# Altium project 1-5kw.PrjPcb (part 2 of 2)

## Sheet 信号采集板.SchDoc
size A2; PageSetup: Record=PageOptions|CenterHorizontal=True|CenterVertical=True|PrintScale=0.50|XCorrection=1.00|YCorrection=1.00|PrintKind=1|BorderSize=5000000|LeftOffset=0|BottomOffset=0|Orientation=2|PaperLength=1000|PaperWidth=1000|Scale=100|PaperSource=15|PrintQuality=600|MediaType=1|DitherType=10|PaperKind=A3|PrintScaleMode=1
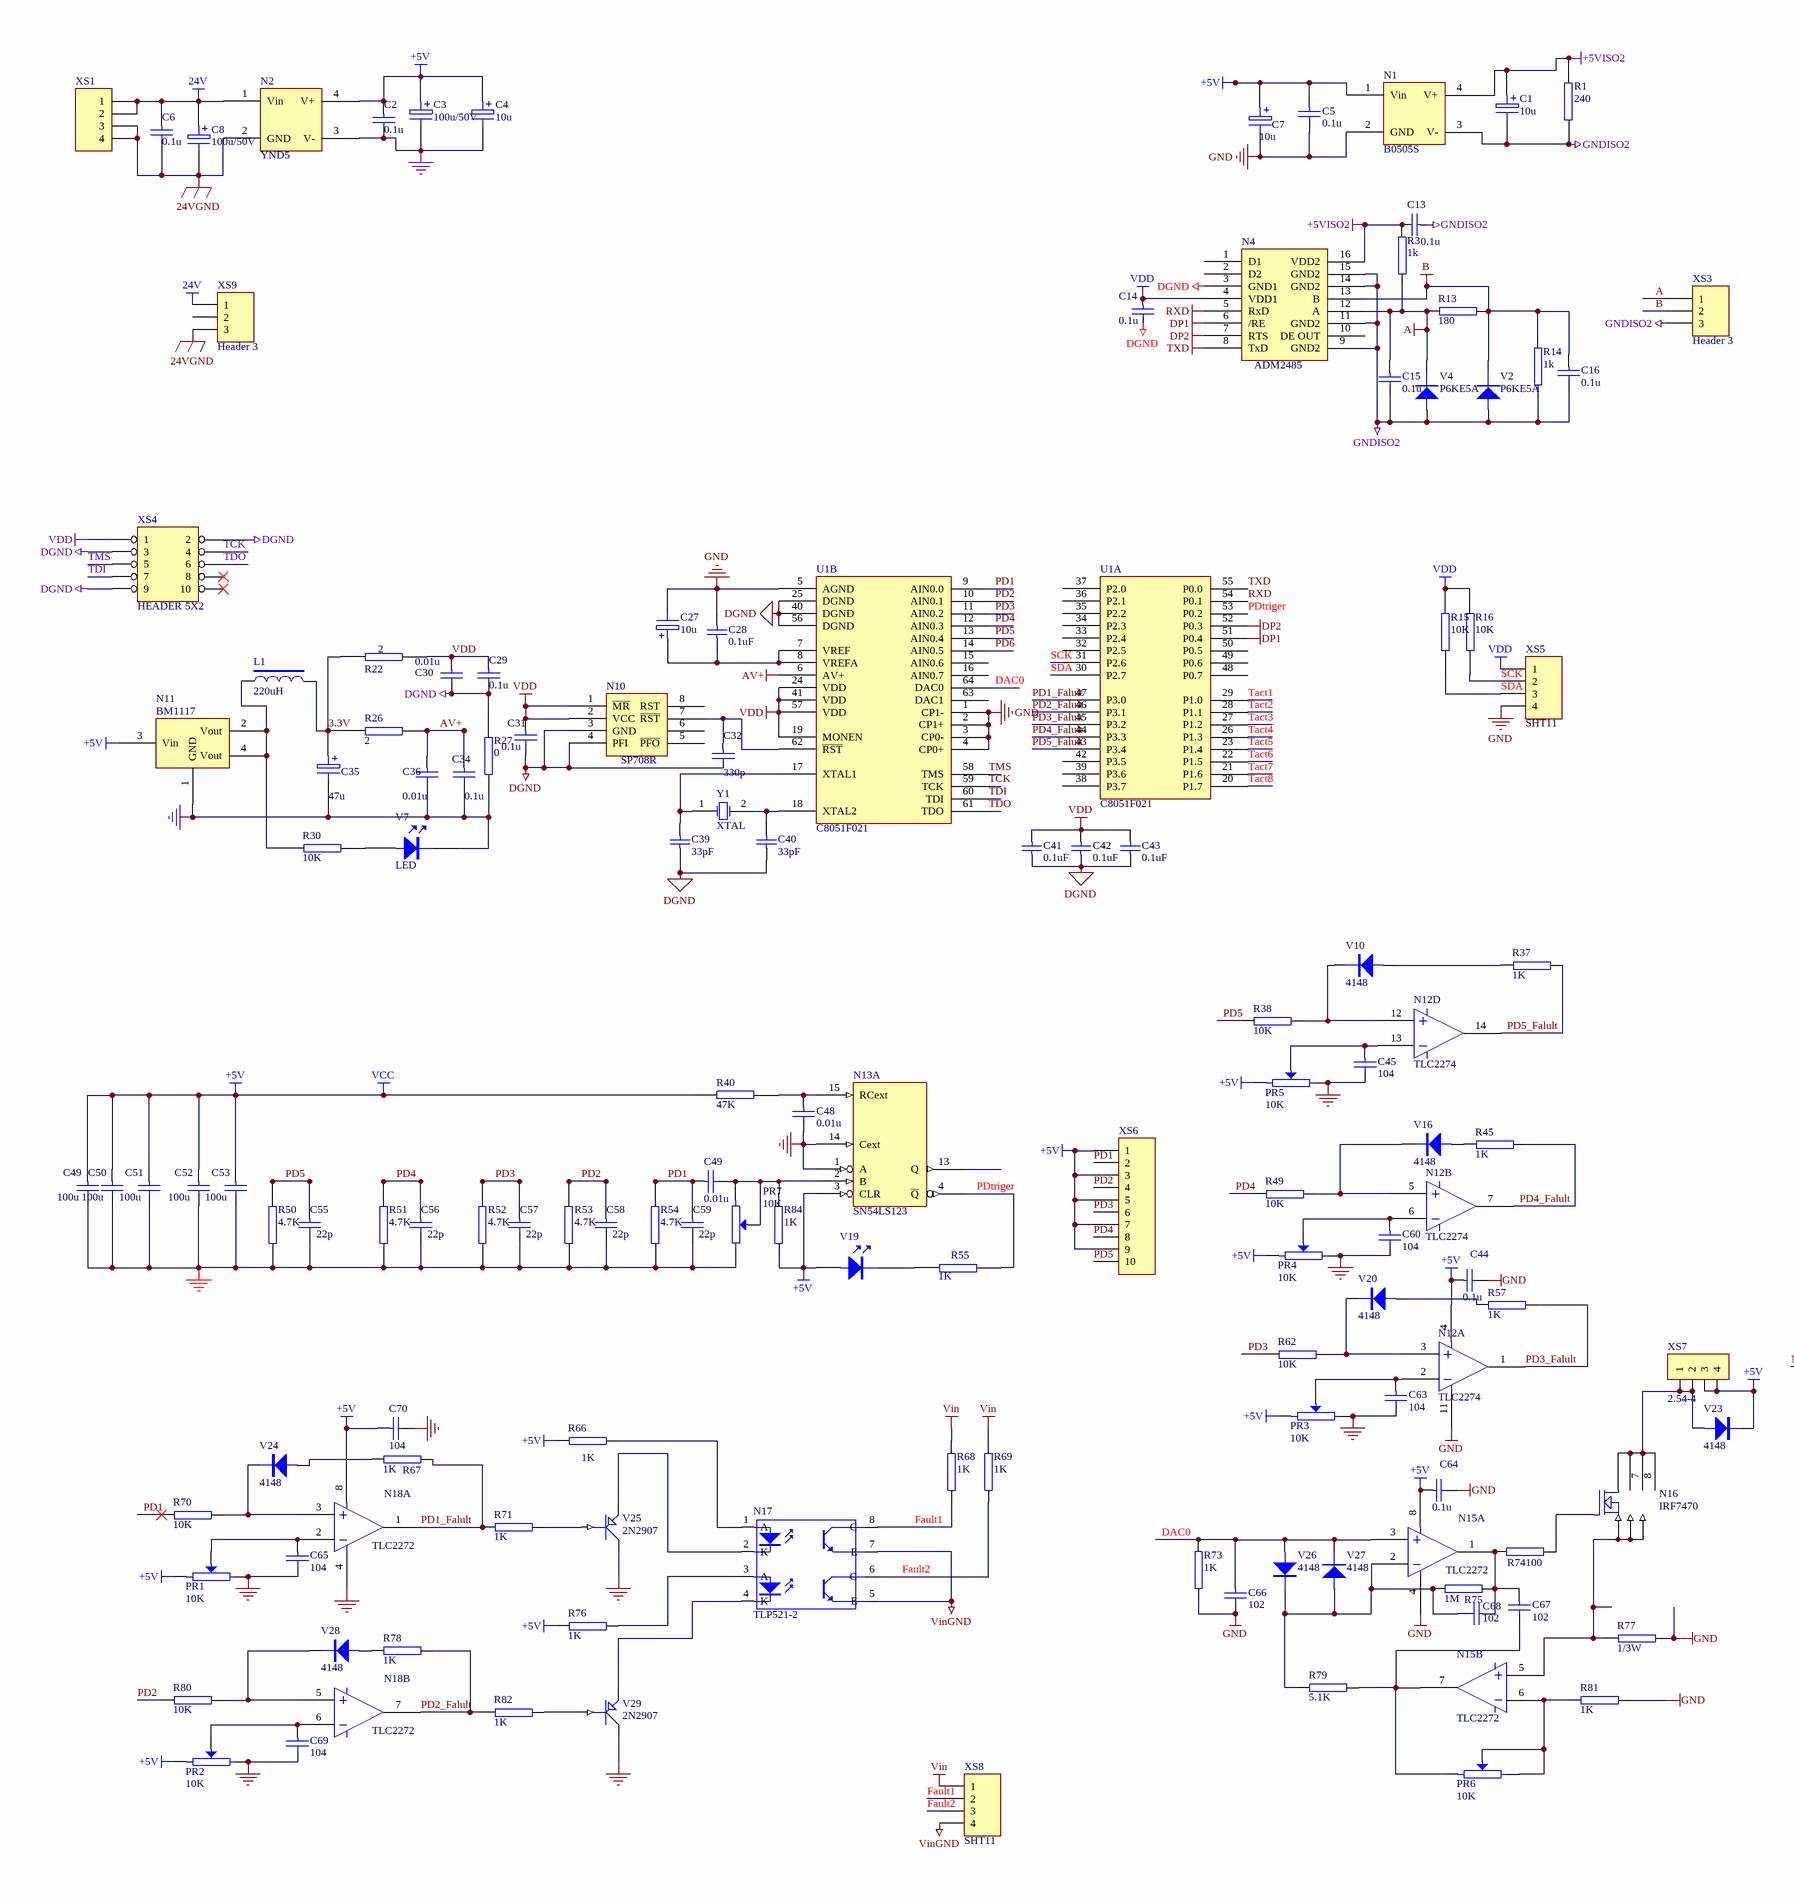
[diagram p4: 信号采集板.SchDoc, left]
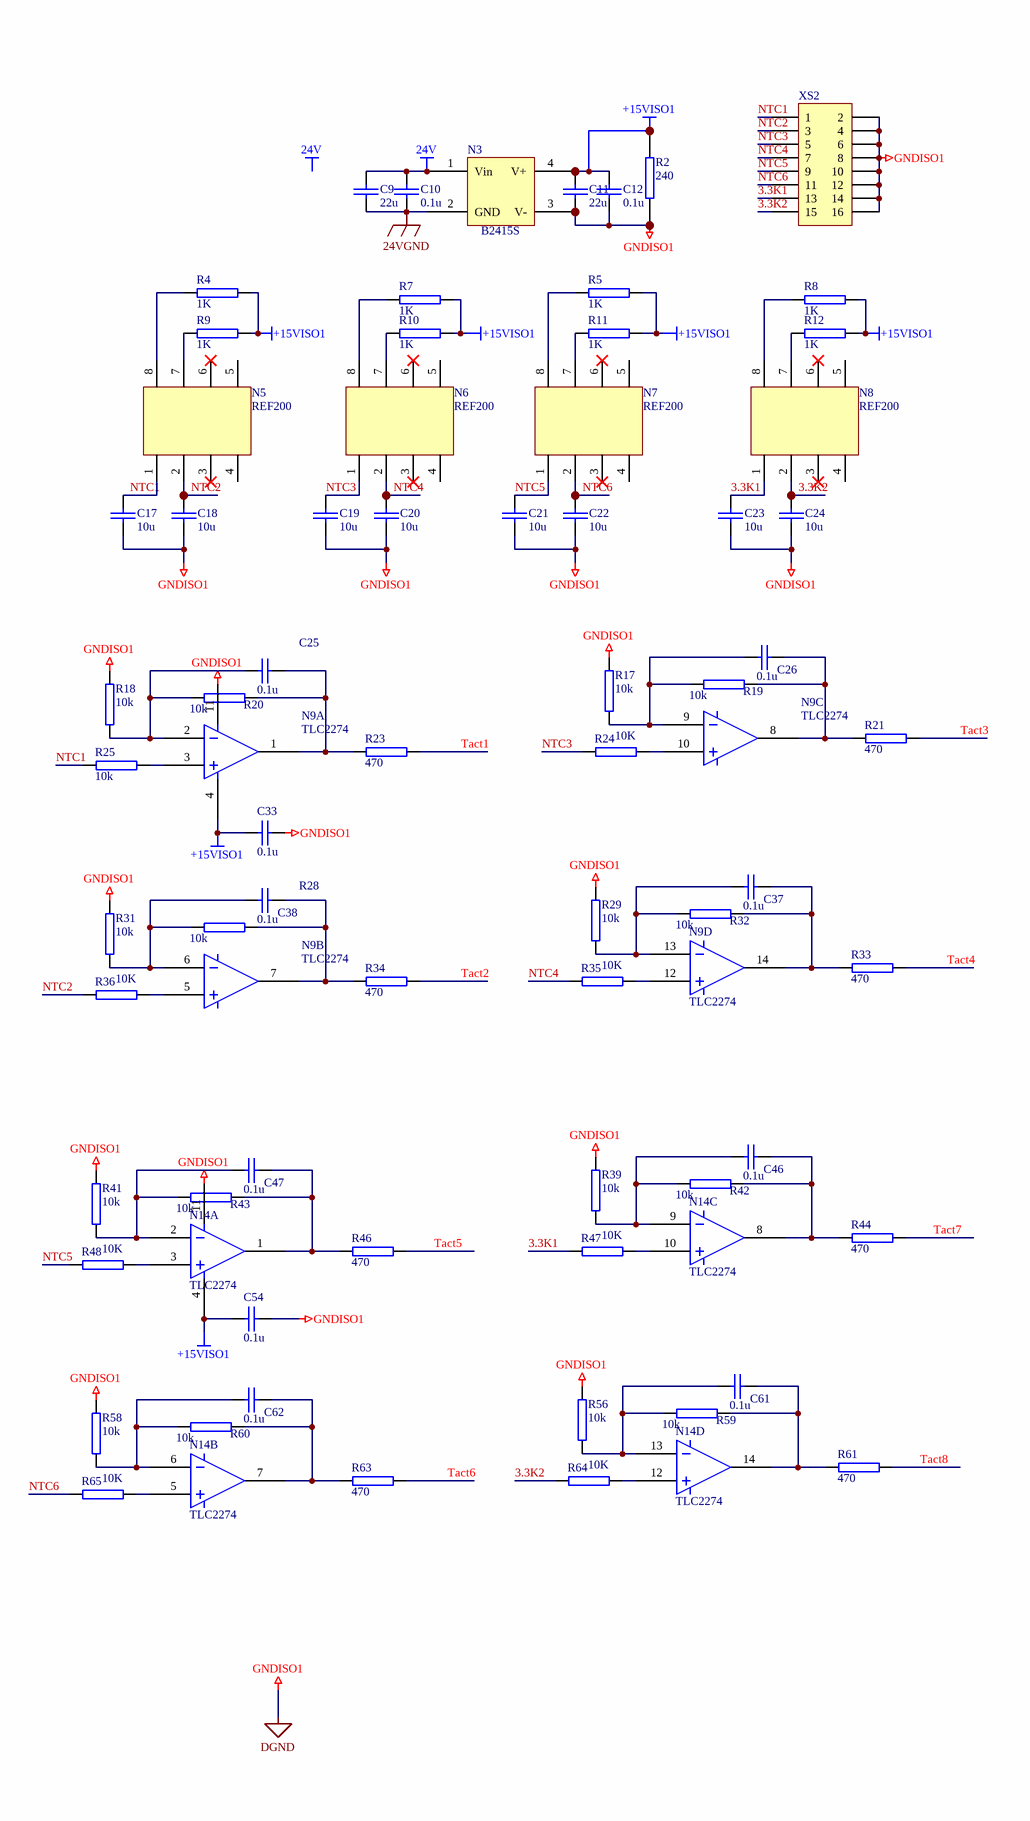
[diagram p5: 信号采集板.SchDoc, right]

### Parts
(Parts that share a designator on the sheet are numbered #1, #2 ... from top to bottom, then left to right.)
C1#3  10u  [1812]
C2#2  0.1u  [1206]
C3#2  100u/50V  [RB3.5-8]
C4#2  10u  [1812]
C5#2  0.1u  [0805]
C6#2  0.1u  [1206]
C7#2  10u  [1812]
C8#2  100u/50V  [RB3.5-8]
C9#2  22u  [1812]
C10#2  0.1u  [0805]
C11#2  22u  [1812]
C12#2  0.1u  [0805]
C13#2  0.1u  [0805]
C14#1  0.1u  [0805]
C15#2  0.1u  [0805]
C16#2  0.1u  [0805]
C17#2  10u  [0805]
C18#2  10u  [0805]
C19#2  10u  [0805]
C20#2  10u  [0805]
C21#2  10u  [0805]
C22#2  10u  [0805]
C23#2  10u  [0805]
C24#2  10u  [0805]
C25#2  0.1u  [0805]
C26#2  0.1u  [0805]
C27#2  10u  [1206A]
C28#2  0.1uF  [0805]
C29#2  0.1u  [0805]
C30#2  0.01u  [0805]
C31#2  0.1u  [0805]
C32#2  330p  [0805]
C33#2  0.1u  [0805]
C34#2  0.1u  [0805]
C35#2  47u  [1812]
C36#2  0.01u  [0805]
C37#2  0.1u  [0805]
C38#2  0.1u  [0805]
C39#2  33pF  [0805]
C40#2  33pF  [0805]
C41#2  0.1uF  [0805]
C42#2  0.1uF  [0805]
C43#2  0.1uF  [0805]
C44#2  0.1u  [0805]
C45#2  104  [0805]
C46#2  0.1u  [0805]
C47#2  0.1u  [0805]
C48#2  0.01u  [0805]
C49#2  100u  [1812]
C49#3  0.01u  [0805]
C50#2  100u  [1812]
C51#2  100u  [1812]
C52#2  100u  [1812]
C53#2  100u  [1812]
C54#2  0.1u  [0805]
C55#2  22p  [0805]
C56#2  22p  [0805]
C57#2  22p  [0805]
C58#2  22p  [0805]
C59#2  22p  [0805]
C60#2  104  [0805]
C61#2  0.1u  [0805]
C62#2  0.1u  [0805]
C63#2  104  [0805]
C64#2  0.1u  [0805]
C65#2  104  [0805]
C66#2  102  [0805]
C67#2  102  [0805]
C68#2  102  [0805]
C69#2  104  [0805]
C70#2  104  [0805]
L1#2  220uH  [1812]
N1#1  B0505S  [B0505LM]
N2#2  YND5  [YND5]
N3#2  B2415S  [B0505LM]
N4#2  ADM2485  [SOIC-16]
N5#2  REF200  [SO-8]
N6#2  REF200  [SO-8]
N7#2  REF200  [SO-8]
N8#2  REF200  [SO-8]
N9#1  TLC2274  [SO-14]  (part D of 4)
N9#2  TLC2274  [SO-14]  (parts A,B,C of 4)
N10#2  SP708R  [SO-8]
N11#2  BM1117  [SOT-223]
N12#2  TLC2274  [SO-14]  (parts A,B,D of 4)
N13#2  SN54LS123  [SO-16]  (part A of 2)
N14#2  TLC2274  [SO-14]  (parts A,B,C,D of 4)
N15#2  TLC2272  [SO-8]  (parts A,B of 2)
N16#2  IRF7470  [SO-8]
N17#2  TLP521-2  [ILEAD-8]
N18#2  TLC2272  [SO-8]  (parts A,B of 2)
PR1  10K  [3296-1]
PR2#1  10K  [3296-1]
PR3#1  10K  [3296-1]
PR4  10K  [3296-1]
PR5  10K  [3296-1]
PR6  10K  [3296-1]
PR7  10K  [3296-1]
R1#2  240  [1206]
R2#2  240  [1206]
R3#2  1k  [0805]
R4#2  1K  [0805]
R5#2  1K  [0805]
R7#2  1K  [0805]
R8#2  1K  [0805]
R9#2  1K  [0805]
R10#2  1K  [0805]
R11#2  1K  [0805]
R12#2  1K  [0805]
R13#2  180  [0805]
R14#2  1k  [0805]
R15#2  10K  [0805]
R16#2  10K  [0805]
R17#2  10k  [0805]
R18#2  10k  [0805]
R19#2  10k  [0805]
R20#2  10k  [0805]
R21#2  470  [0805]
R22#2  2  [1210]
R23#2  470  [0805]
R24#2  10K  [0805]
R25#2  10k  [0805]
R26#2  2  [1210]
R27#2  0  [1206]
R28#2  10k  [0805]
R29#2  10k  [0805]
R30#2  10K  [0805]
R31#2  10k  [0805]
R32#2  10k  [0805]
R33#2  470  [0805]
R34#2  470  [0805]
R35#2  10K  [0805]
R36#2  10K  [0805]
R37#2  1K  [0805]
R38#2  10K  [0805]
R39#2  10k  [0805]
R40#2  47K  [0805]
R41#2  10k  [0805]
R42#2  10k  [0805]
R43#2  10k  [0805]
R44#2  470  [0805]
R45#2  1K  [0805]
R46#2  470  [0805]
R47#2  10K  [0805]
R48#2  10K  [0805]
R49#2  10K  [0805]
R50#2  4.7K  [0805]
R51#2  4.7K  [0805]
R52#2  4.7K  [0805]
R53#2  4.7K  [0805]
R54#2  4.7K  [0805]
R55#2  1K  [0805]
R56#2  10k  [0805]
R57#2  1K  [0805]
R58#2  10k  [0805]
R59#2  10k  [0805]
R60#2  10k  [0805]
R61#2  470  [0805]
R62#2  10K  [0805]
R63#2  470  [0805]
R64#2  10K  [0805]
R65#2  10K  [0805]
R66#2  1K  [0805]
R67#2  1K  [0805]
R68#2  1K  [0805]
R69#2  1K  [0805]
R70#2  10K  [0805]
R71#2  1K  [0805]
R73#2  1K  [0805]
R74#2  100  [0805]
R75#2  1M  [0805]
R76#2  1K  [0805]
R77#2  1/3W  [1812]
R78#2  1K  [0805]
R79#2  5.1K  [0805]
R80#2  10K  [0805]
R81#2  1K  [0805]
R82#2  1K  [0805]
R84#2  1K  [0805]
U1#2  C8051F021  [TQFP-64]  (parts A,B of 2)
V2#2  P6KE5A  [1206-D]
V4#2  P6KE5A  [1206-D]
V7#2  LED  [1206A]
V10#2  4148  [1206-D]
V16#2  4148  [1206-D]
V19#2  LED  [1206a]  (value not drawn)
V20#2  4148  [1206-D]
V23  4148  [1206-D]
V24#2  4148  [1206-D]
V25#2  2N2907  [SOT-23]
V26#2  4148  [1206-D]
V27#2  4148  [1206-D]
V28#2  4148  [1206-D]
V29#2  2N2907  [SOT-23]
XS1#8  Header 4  [SIP-4]  (value not drawn)
XS2#7  Header 8X2  [HDR2X8]  (value not drawn)
XS3#2  Header 3  [SIP-3]
XS4#5  HEADER 5X2  [IDC-10]
XS5#3  SHT11  [SIP-4]
XS6#3  Header 10  [SIP-10]  (value not drawn)
XS7#3  2.54-4  [SIP-4]
XS8#3  SHT11  [SIP-4]
XS9#2  Header 3  [SIP-3]
Y1  XTAL  [CRY]

### Nets
24V: C6#2.1 C8#2.1 C9#2.1 C10#2.2 N2#2.1(Vin) N3#2.1(Vin) XS1#8.1 XS1#8.2 XS9#2.1
24VGND: C6#2.2 C8#2.2 C9#2.2 C10#2.1 N2#2.2(GND) N3#2.2(GND) XS1#8.3 XS1#8.4 XS9#2.3
+5V: C2#2.1 C3#2.1 C4#2.1 C5#2.1 C7#2.1 C44#2.1 C49#2.1 C50#2.1 C51#2.1 C52#2.1 C53#2.1 C64#2.1 C70#2.1 N1#1.1(Vin) N2#2.4(V+) N11#2.3(Vin) N12#2.4 N13#2.3(CLR) N13#2.16(VCC) N15#2.8 N18#2.8 PR1.1 PR2#1.1 PR3#1.1 PR4.1 PR5.1 R40#2.2 R66#2.1 R76#2.1 R84#2.1 V19#2.1 V23.K XS6#3.1 XS6#3.3 XS6#3.5 XS6#3.7 XS6#3.9 XS7#3.3 XS7#3.4  [also labelled VCC]
+5VISO2: C1#3.1 C13#2.2 N1#1.4(V+) N4#2.16(VDD2) R1#2.2 R3#2.1
+15VISO1: C11#2.1 C12#2.2 C33#2.1 C54#2.1 N3#2.4(V+) N9#2.4 N14#2.4 R2#2.2 R4#2.1 R5#2.1 R7#2.1 R8#2.1 R9#2.1 R10#2.1 R11#2.1 R12#2.1
A: C15#2.1 N4#2.12(A) R3#2.2 R13#2.1 V4#2.K XS3#2.1
AV+: C34#2.1 C36#2.1 R26#2.2 U1#2.6(AV+)
B: C16#2.1 N4#2.13(B) R13#2.2 R14#2.1 V2#2.K XS3#2.2
D: N16#2.5(D) N16#2.6(D) N16#2.7(D) N16#2.8(D) V23.A XS7#3.1 XS7#3.2
DGND: C11#2.2 C12#2.1 C14#1.2 C17#2.1 C18#2.1 C19#2.1 C20#2.1 C21#2.1 C22#2.1 C23#2.1 C24#2.1 C29#2.2 C30#2.2 C31#2.2 C32#2.2 C33#2.2 C39#2.1 C40#2.1 C41#2.1 C42#2.1 C43#2.1 C54#2.2 N3#2.3(V-) N4#2.3(GND1) N9#2.11 N10#2.3(GND) N10#2.4(PFI) N14#2.11 R2#2.1 R17#2.2 R18#2.2 R27#2.2 R29#2.2 R31#2.2 R39#2.2 R41#2.2 R56#2.2 R58#2.2 U1#2.25(DGND) U1#2.40(DGND) U1#2.56(DGND) XS2#7.2 XS2#7.4 XS2#7.6 XS2#7.8 XS2#7.10 XS2#7.12 XS2#7.14 XS2#7.16 XS4#5.2 XS4#5.3 XS4#5.9  [also labelled GNDISO1]
DP1: N4#2.6(/RE) U1#2.51(P0.4)
DP2: N4#2.7(RTS) U1#2.52(P0.3)
GND: C2#2.2 C3#2.2 C4#2.2 C5#2.2 C7#2.2 C27#2.2 C28#2.2 C34#2.2 C35#2.2 C36#2.2 C44#2.2 C45#2.2 C48#2.2 C49#2.2 C50#2.2 C51#2.2 C52#2.2 C53#2.2 C55#2.2 C56#2.2 C57#2.2 C58#2.2 C59#2.2 C60#2.2 C63#2.2 C64#2.2 C65#2.2 C66#2.2 C69#2.2 C70#2.2 N1#1.2(GND) N2#2.3(V-) N11#2.1(GND) N12#2.11 N13#2.1(A) N13#2.8(GND) N13#2.14(Cext) N15#2.4 N18#2.4 PR1.2 PR2#1.2 PR3#1.2 PR4.2 PR5.2 PR7.2 R27#2.1 R50#2.1 R51#2.1 R52#2.1 R53#2.1 R54#2.1 R73#2.2 R77#2.2 R81#2.2 U1#2.1(CP1-) U1#2.2(CP1+) U1#2.3(CP0-) U1#2.4(CP0+) U1#2.5(AGND) V7#2.2 V25#2.C V29#2.C XS5#3.4
GNDISO2: C1#3.2 C13#2.1 C15#2.2 C16#2.2 N1#1.3(V-) N4#2.9(GND2) N4#2.11(GND2) N4#2.14(GND2) N4#2.15(GND2) R1#2.1 R14#2.2 V2#2.A V4#2.A XS3#2.3
RXD: N4#2.5(RxD) U1#2.54(P0.1)
S: N15#2.5 N16#2.1(S) N16#2.2(S) N16#2.3(S) R77#2.1
TXD: N4#2.8(TxD) U1#2.55(P0.0)
VDD: C14#1.1 C29#2.1 C30#2.1 C31#2.1 C41#2.2 C42#2.2 C43#2.2 N4#2.4(VDD1) N10#2.1(~{MR}) N10#2.2(VCC) R15#2.1 R16#2.1 R22#2.2 U1#2.19(MONEN) U1#2.24(VDD) U1#2.41(VDD) U1#2.57(VDD) XS4#5.1 XS5#3.1
Vin: R68#2.2 R69#2.2 XS8#3.1
VinGND: N17#2.5(E) N17#2.7(E) XS8#3.4
3.3K1: C23#2.2 N8#2.1 R47#2.2 XS2#7.13
3.3K2: C24#2.2 N8#2.2 R64#2.2 XS2#7.15
3.3V: C35#2.1 L1#2.2 R22#2.1 R26#2.1
DAC0: C66#2.1 N15#2.3 R73#2.1 U1#2.64(DAC0) V26#2.A V27#2.K
Fault1: N17#2.8(C) R68#2.1 XS8#3.2
Fault2: N17#2.6(C) R69#2.1 XS8#3.3
NTC1: C17#2.2 N5#2.1 R25#2.2 XS2#7.1
NTC2: C18#2.2 N5#2.2 R36#2.2 XS2#7.3
NTC3: C19#2.2 N6#2.1 R24#2.2 XS2#7.5
NTC4: C20#2.2 N6#2.2 R35#2.2 XS2#7.7
NTC5: C21#2.2 N7#2.1 R48#2.2 XS2#7.9
NTC6: C22#2.2 N7#2.2 R65#2.2 XS2#7.11
PD1: C49#3.1 C59#2.1 R54#2.2 R70#2.1 U1#2.9(AIN0.0) XS6#3.2
PD1_Falult: N18#2.1 R67#2.2 R71#2.1 U1#2.47(P3.0)
PD2: C58#2.1 R53#2.2 R80#2.1 U1#2.10(AIN0.1) XS6#3.4
PD2_Falult: N18#2.7 R78#2.2 R82#2.1 U1#2.46(P3.1)
PD3: C57#2.1 R52#2.2 R62#2.1 U1#2.11(AIN0.2) XS6#3.6
PD3_Falult: N12#2.1 R57#2.2 U1#2.45(P3.2)
PD4: C56#2.1 R49#2.1 R51#2.2 U1#2.12(AIN0.3) XS6#3.8
PD4_Falult: N12#2.7 R45#2.2 U1#2.44(P3.3)
PD5: C55#2.1 R38#2.1 R50#2.2 U1#2.13(AIN0.4) XS6#3.10
PD5_Falult: N12#2.14 R37#2.2 U1#2.43(P3.4)
PD6: U1#2.14(AIN0.5)
PDtriger: N13#2.4(~{Q}) R55#2.2 U1#2.53(P0.2)
SCK: R16#2.2 U1#2.31(P2.6) XS5#3.2
SDA: R15#2.2 U1#2.30(P2.7) XS5#3.3
Tact1: R23#2.2 U1#2.29(P1.0)
Tact2: R34#2.2 U1#2.28(P1.1)
Tact3: R21#2.2 U1#2.27(P1.2)
Tact4: R33#2.2 U1#2.26(P1.3)
Tact5: R46#2.2 U1#2.23(P1.4)
Tact6: R63#2.2 U1#2.22(P1.5)
Tact7: R44#2.2 U1#2.21(P1.6)
Tact8: R61#2.2 U1#2.20(P1.7)
TCK: U1#2.59(TCK) XS4#5.4
TDI: U1#2.60(TDI) XS4#5.7
TDO: U1#2.61(TDO) XS4#5.6
TMS: U1#2.58(TMS) XS4#5.5
NetC25#2_1: C25#2.1 N9#2.2 R18#2.1 R20#2.1
NetC25#2_2: C25#2.2 N9#2.1 R20#2.2 R23#2.1
NetC26#2_1: C26#2.1 N9#2.9 R17#2.1 R19#2.1
NetC26#2_2: C26#2.2 N9#2.8 R19#2.2 R21#2.1
NetC27#2_1: C27#2.1 C28#2.1 U1#2.7(VREF) U1#2.8(VREFA)
NetC32#2_1: C32#2.1 N10#2.7(~{RST}) U1#2.62(~{RST})
NetC37#2_1: C37#2.1 N9#1.13 R29#2.1 R32#2.1
NetC37#2_2: C37#2.2 N9#1.14 R32#2.2 R33#2.1
NetC38#2_1: C38#2.1 N9#2.6 R28#2.1 R31#2.1
NetC38#2_2: C38#2.2 N9#2.7 R28#2.2 R34#2.1
NetC39#2_2: C39#2.2 U1#2.17(XTAL1) Y1.1(OSC1)
NetC40#2_2: C40#2.2 U1#2.18(XTAL2) Y1.2(OSC2)
NetC45#2_1: C45#2.1 N12#2.13 PR5.W
NetC46#2_1: C46#2.1 N14#2.9 R39#2.1 R42#2.1
NetC46#2_2: C46#2.2 N14#2.8 R42#2.2 R44#2.1
NetC47#2_1: C47#2.1 N14#2.2 R41#2.1 R43#2.1
NetC47#2_2: C47#2.2 N14#2.1 R43#2.2 R46#2.1
NetC48#2_1: C48#2.1 N13#2.15(RCext) R40#2.1
NetC49#3_2: C49#3.2 N13#2.2(B) PR7.1 PR7.W R84#2.2
NetC60#2_1: C60#2.1 N12#2.6 PR4.W
NetC61#2_1: C61#2.1 N14#2.13 R56#2.1 R59#2.1
NetC61#2_2: C61#2.2 N14#2.14 R59#2.2 R61#2.1
NetC62#2_1: C62#2.1 N14#2.6 R58#2.1 R60#2.1
NetC62#2_2: C62#2.2 N14#2.7 R60#2.2 R63#2.1
NetC63#2_1: C63#2.1 N12#2.2 PR3#1.W
NetC65#2_1: C65#2.1 N18#2.2 PR1.W
NetC67#2_1: C67#2.1 C68#2.1 N15#2.1 R74#2.2 R75#2.1
NetC67#2_2: C67#2.2 N15#2.7 PR6.1 R79#2.2
NetC68#2_2: C68#2.2 N15#2.2 R75#2.2 R79#2.1 V26#2.K V27#2.A
NetC69#2_1: C69#2.1 N18#2.6 PR2#1.W
NetL1#2_1: L1#2.1 N11#2.2(Vout) N11#2.4(Vout) R30#2.1
NetN5#2_7: N5#2.7 R9#2.2
NetN5#2_8: N5#2.8 R4#2.2
NetN6#2_7: N6#2.7 R10#2.2
NetN6#2_8: N6#2.8 R7#2.2
NetN7#2_7: N7#2.7 R11#2.2
NetN7#2_8: N7#2.8 R5#2.2
NetN8#2_7: N8#2.7 R12#2.2
NetN8#2_8: N8#2.8 R8#2.2
NetN9#1_12: N9#1.12 R35#2.1
NetN9#2_3: N9#2.3 R25#2.1
NetN9#2_5: N9#2.5 R36#2.1
NetN9#2_10: N9#2.10 R24#2.1
NetN12#2_3: N12#2.3 R62#2.2 V20#2.K
NetN12#2_5: N12#2.5 R49#2.2 V16#2.K
NetN12#2_12: N12#2.12 R38#2.2 V10#2.K
NetN14#2_3: N14#2.3 R48#2.1
NetN14#2_5: N14#2.5 R65#2.1
NetN14#2_10: N14#2.10 R47#2.1
NetN14#2_12: N14#2.12 R64#2.1
NetN15#2_6: N15#2.6 PR6.2 PR6.W R81#2.1
NetN16#2_4: N16#2.4(G) R74#2.1
NetN17#2_1: N17#2.1(A) R66#2.2
NetN17#2_2: N17#2.2(K) V25#2.E
NetN17#2_3: N17#2.3(A) R76#2.2
NetN17#2_4: N17#2.4(K) V29#2.E
NetN18#2_3: N18#2.3 R70#2.2 V24#2.K
NetN18#2_5: N18#2.5 R80#2.2 V28#2.K
NetR30#2_2: R30#2.2 V7#2.1
NetR37#2_1: R37#2.1 V10#2.A
NetR45#2_1: R45#2.1 V16#2.A
NetR55#2_1: R55#2.1 V19#2.2
NetR57#2_1: R57#2.1 V20#2.A
NetR67#2_1: R67#2.1 V24#2.A
NetR71#2_2: R71#2.2 V25#2.B
NetR78#2_1: R78#2.1 V28#2.A
NetR82#2_2: R82#2.2 V29#2.B

Not connected (* = marked no-connect by the designer): N4#2 1(D1) 2(D2) 10(DE_OUT); N5#2 3* 4 5 6*; N6#2 3* 4 5 6*; N7#2 3* 4 5 6*; N8#2 3* 4 5 6*; N10#2 5(~{PFO}) 6 8(RST); N13#2 13(Q); U1#2 15(AIN0.6) 16(AIN0.7) 32(P2.5) 33(P2.4) 34(P2.3) 35(P2.2) 36(P2.1) 37(P2.0) 38(P3.7) 39(P3.6) 42(P3.5) 48(P0.7) 49(P0.6) 50(P0.5) 63(DAC1); XS4#5 8* 10*; XS9#2 2

### Notes on the sheet
- Labels drawn without touching a wire or pin: 24V

### Library data of the parts
C1#3 C3#2 C4#2 C7#2 C8#2 C27#2 C35#2 = ELECTRO1: Electrolytic Capacitor
C2#2 C5#2 C6#2 C9#2 C11#2 C15#2 C16#2 C29#2 C30#2 C31#2 C34#2 C36#2 C48#2 C49#2 C49#3 C50#2 C51#2 C52#2 C53#2 C55#2 C56#2 C57#2 C58#2 C59#2 = CAP: Capacitor
C10#2 C12#2 C13#2 C14#1 C17#2 C18#2 C19#2 C20#2 C21#2 C22#2 C23#2 C24#2 C25#2 C26#2 C32#2 C33#2 C37#2 C38#2 C44#2 C45#2 C46#2 C47#2 C54#2 C60#2 C61#2 C62#2 C63#2 C64#2 C65#2 C66#2 C67#2 C68#2 C69#2 C70#2 = CAP
C28#2 C39#2 C40#2 C41#2 C42#2 C43#2 = Cap: Capacitor; Published: 8-Jun-2000; LatestRevisionDate: 17-Jul-2002; LatestRevisionNote: Re-released for DXP Platform.; PackageReference: RAD-0.3; Publisher: Altium Limited
  C28#2 C41#2 C42#2 C43#2: Value: 0.1uF
  C39#2 C40#2: Value: 33pF
L1#2 = L
N1#1 N2#2 N3#2 = B0505LM
N5#2 N6#2 N7#2 N8#2 = EF200
N9#1 N9#2 N12#2 N14#2 = LM124
N13#2 = 74LS123
N15#2 N18#2 = 1458
N16#2 = MOSFET N
N17#2 = TLP521-2: Optoisolator
PR1 PR2#1 PR3#1 PR4-PR7 = POT
R1#2 R2#2 R13#2 R15#2 R16#2 R22#2 R26#2 R27#2 R30#2 R37#2 R38#2 R40#2 R45#2 R49#2 R50#2 R51#2 R52#2 R53#2 R54#2 R55#2 R57#2 R62#2 R66#2 R67#2 R68#2 R69#2 R70#2 R71#2 R73#2 R74#2 R75#2 R76#2 R77#2 R78#2 R79#2 R80#2 R81#2 R82#2 R84#2 = RES2
R3#2 R4#2 R5#2 R7#2 R8#2 R9#2 R10#2 R11#2 R12#2 R14#2 R17#2 R18#2 R19#2 R20#2 R21#2 R23#2 R24#2 R25#2 R28#2 R29#2 R31#2 R32#2 R33#2 R34#2 R35#2 R36#2 R39#2 R41#2 R42#2 R43#2 R44#2 R46#2 R47#2 R48#2 R56#2 R58#2 R59#2 R60#2 R61#2 R63#2 R64#2 R65#2 = R
V2#2 V4#2 V10#2 V16#2 V20#2 V23 V24#2 V26#2 V27#2 V28#2 = DIODE
V25#2 V29#2 = PNP2
XS1#8 XS5#3 XS8#3 = Header 4: Header, 4-Pin; LatestRevisionDate: 17-Jul-2002; LatestRevisionNote: Re-released for DXP Platform.; Publisher: Altium Limited
XS2#7 = Header 8X2: Header, 8-Pin, Dual row; LatestRevisionDate: 17-Jul-2002; LatestRevisionNote: Re-released for DXP Platform.; Publisher: Altium Limited
XS3#2 XS9#2 = Header 3: Header, 3-Pin; LatestRevisionDate: 17-Jul-2002; LatestRevisionNote: Re-released for DXP Platform.; Publisher: Altium Limited
XS6#3 = Header 10: Header, 10-Pin; LatestRevisionDate: 17-Jul-2002; LatestRevisionNote: Re-released for DXP Platform.; Publisher: Altium Limited
XS7#3 = CON4
Y1 = XTAL: Crystal Oscillator; Published: 8-Jun-2000; LatestRevisionDate: 17-Jul-2002; LatestRevisionNote: Re-released for DXP Platform.; PackageReference: R38; Publisher: Altium Limited; PackageDescription: Crystal, Thru-Hole; 2 Leads; Body 3.1 x 8.2 mm (Dia.xH)

## Sheet 走线图3.SchDoc
size A3; PageSetup: Record=PageOptions|CenterHorizontal=True|CenterVertical=True|PrintScale=0.72|XCorrection=1.00|YCorrection=1.00|PrintKind=1|BorderSize=5000000|LeftOffset=0|BottomOffset=0|Orientation=1|PaperLength=1000|PaperWidth=1000|Scale=100|PaperSource=260|PrintQuality=600|MediaType=1|DitherType=10|PaperKind=A3|PrintScaleMode=1
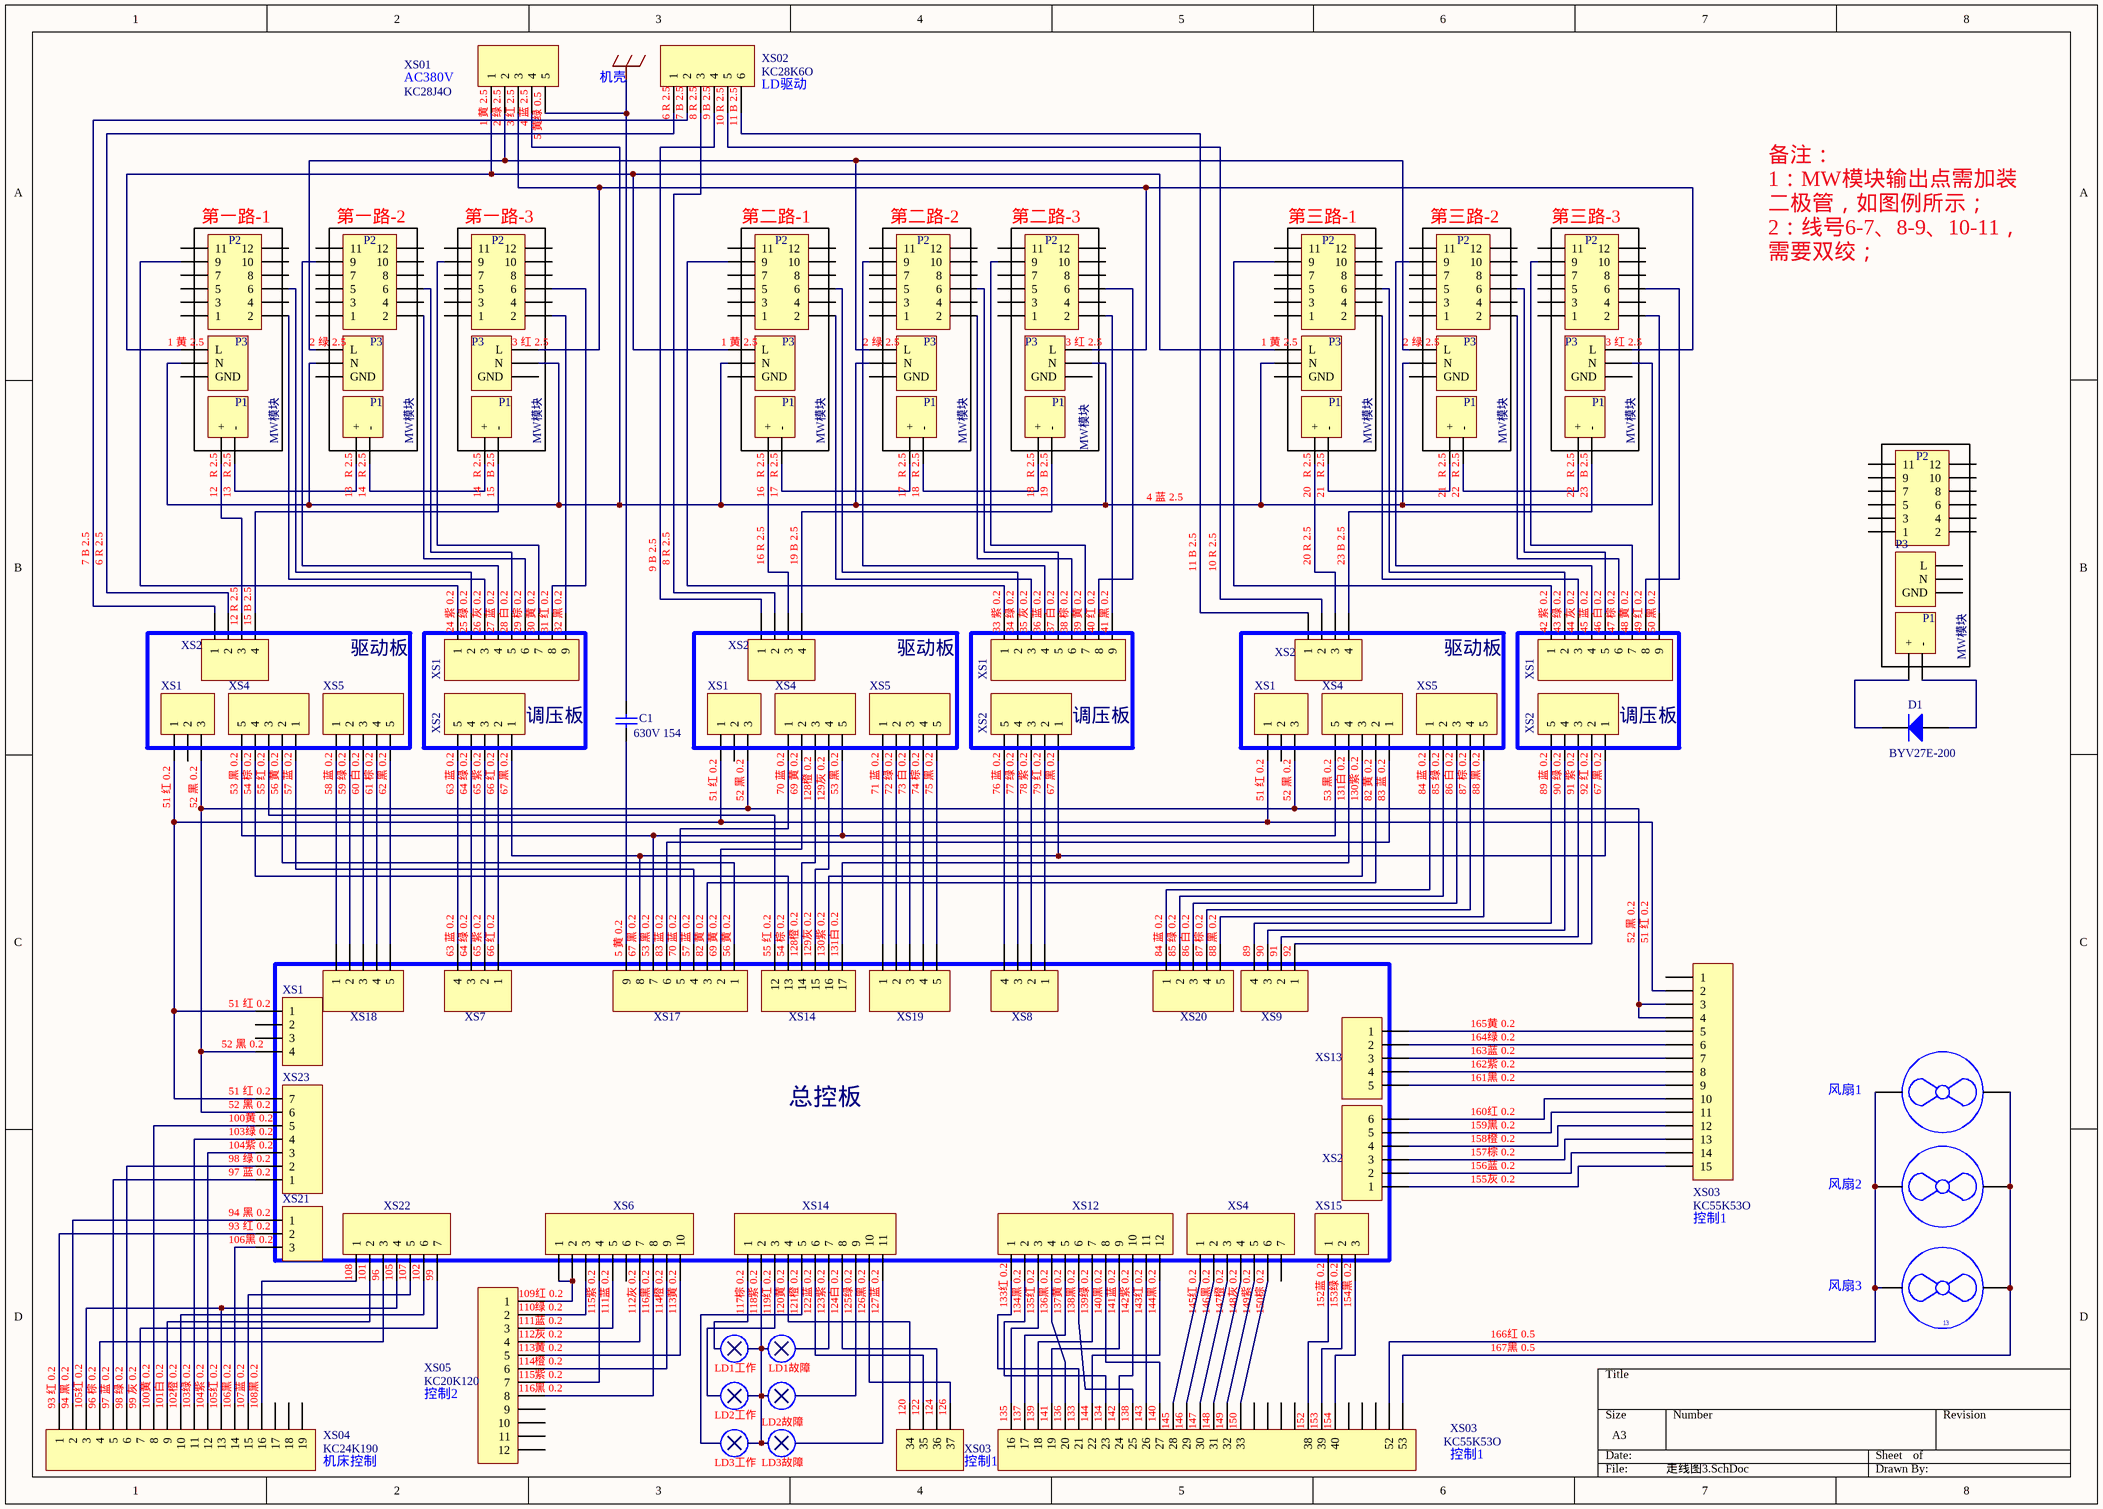
[diagram p6: 走线图3.SchDoc]

### Parts
(Parts that share a designator on the sheet are numbered #1, #2 ... from top to bottom, then left to right.)
?#2  (no value)
?#3  (no value)
?#4  (no value)
C1#4  value 630V 154  [RAD-0.3]  (hidden comment: Cap)
D1#3  BYV27E-200  [DIO18.84-9.6x5.6]
P1#8  Header 2  [HDR1X2]  (value not drawn)
P1#9  Header 2  [HDR1X2]  (value not drawn)
P1#10  Header 2  [HDR1X2]  (value not drawn)
P1#11  Header 2  [HDR1X2]  (value not drawn)
P1#12  Header 2  [HDR1X2]  (value not drawn)
P1#13  Header 2  [HDR1X2]  (value not drawn)
P1#14  Header 2  [HDR1X2]  (value not drawn)
P1#15  Header 2  [HDR1X2]  (value not drawn)
P1#16  Header 2  [HDR1X2]  (value not drawn)
P1#17  Header 2  [HDR1X2]  (value not drawn)
P2#8  Header 6X2H  [HDR2X6H]  (value not drawn)
P2#9  Header 6X2H  [HDR2X6H]  (value not drawn)
P2#10  Header 6X2H  [HDR2X6H]  (value not drawn)
P2#11  Header 6X2H  [HDR2X6H]  (value not drawn)
P2#12  Header 6X2H  [HDR2X6H]  (value not drawn)
P2#13  Header 6X2H  [HDR2X6H]  (value not drawn)
P2#14  Header 6X2H  [HDR2X6H]  (value not drawn)
P2#15  Header 6X2H  [HDR2X6H]  (value not drawn)
P2#16  Header 6X2H  [HDR2X6H]  (value not drawn)
P2#17  Header 6X2H  [HDR2X6H]  (value not drawn)
P3#8  Header 3  [HDR1X3]  (value not drawn)
P3#9  Header 3  [HDR1X3]  (value not drawn)
P3#10  Header 3  [HDR1X3]  (value not drawn)
P3#11  Header 3  [HDR1X3]  (value not drawn)
P3#12  Header 3  [HDR1X3]  (value not drawn)
P3#13  Header 3  [HDR1X3]  (value not drawn)
P3#14  Header 3  [HDR1X3]  (value not drawn)
P3#15  Header 3  [HDR1X3]  (value not drawn)
P3#16  Header 3  [HDR1X3]  (value not drawn)
P3#17  Header 3  [HDR1X3]  (value not drawn)
XS01  KC28J4O  [HDR1X5]
XS1#9  Header 9  [HDR1X9]  (value not drawn)
XS1#10  Header 9  [HDR1X9]  (value not drawn)
XS1#11  Header 9  [HDR1X9]  (value not drawn)
XS1#12  Header 3  [HDR1X3]  (value not drawn)
XS1#13  Header 3  [HDR1X3]  (value not drawn)
XS1#14  Header 3  [HDR1X3]  (value not drawn)
XS1#15  Header 4  [HDR1X4]  (value not drawn)
XS02  KC28K6O  [HDR1X6]
XS2#8  Header 4  [HDR1X4]  (value not drawn)
XS2#9  Header 4  [HDR1X4]  (value not drawn)
XS2#10  Header 4  [HDR1X4]  (value not drawn)
XS2#11  Header 5  [HDR1X5]  (value not drawn)
XS2#12  Header 5  [HDR1X5]  (value not drawn)
XS2#13  Header 5  [HDR1X5]  (value not drawn)
XS2#14  Header 6  [HDR1X6]  (value not drawn)
XS03#1  KC55K53O  [HDR1X15]
XS03#2  Header 4  [HDR1X4]  (value not drawn)
XS03#3  KC55K53O  [HDR1X30]
XS04  KC24K190  [HDR1X19]
XS4#6  Header 5  [HDR1X5]  (value not drawn)
XS4#7  Header 5  [HDR1X5]  (value not drawn)
XS4#8  Header 5  [HDR1X5]  (value not drawn)
XS4#9  Header 7  [HDR1X7]  (value not drawn)
XS05  KC20K120  [HDR1X12]
XS5#4  Header 5  [HDR1X5]  (value not drawn)
XS5#5  Header 5  [HDR1X5]  (value not drawn)
XS5#6  Header 5  [HDR1X5]  (value not drawn)
XS6#4  Header 10  [HDR1X10]  (value not drawn)
XS7#4  Header 4  [HDR1X4]  (value not drawn)
XS8#4  Header 4  [HDR1X4]  (value not drawn)
XS9#3  Header 4  [HDR1X4]  (value not drawn)
XS12#3  Header 12  [HDR1X12]  (value not drawn)
XS13#2  Header 5  [HDR1X5]  (value not drawn)
XS14#4  Header 6  [HDR1X6]  (value not drawn)
XS14#5  Header 11  [HDR1X11]  (value not drawn)
XS15#3  Header 3  [HDR1X3]  (value not drawn)
XS17#3  Header 9  [HDR1X9]  (value not drawn)
XS18#3  Header 5  [HDR1X5]  (value not drawn)
XS19#3  Header 5  [HDR1X5]  (value not drawn)
XS20#2  Header 5  [HDR1X5]  (value not drawn)
XS21#2  Header 3  [HDR1X3]  (value not drawn)
XS22#2  Header 7  [HDR1X7]  (value not drawn)
XS23#3  Header 7  [HDR1X7]  (value not drawn)

### Blocks framed on the sheet
第一路-1: P1#8 P2#8 P3#8
第一路-2: P1#9 P2#9 P3#9
第一路-3: P1#10 P2#10 P3#10
第二路-1: P1#11 P2#11 P3#11
第二路-2: P1#12 P2#12 P3#12
第二路-3: P1#13 P2#13 P3#13
第三路-1: P1#14 P2#14 P3#14
第三路-2: P1#15 P2#15 P3#15
第三路-3: P1#16 P2#16 P3#16
驱动板: XS1#12 XS2#8 XS4#6 XS5#4
调压板: XS1#9 XS2#11
驱动板: XS1#13 XS2#9 XS4#7 XS5#5
调压板: XS1#10 XS2#12
驱动板: XS1#14 XS2#10 XS4#8 XS5#6
调压板: XS1#11 XS2#13
总控板: XS1#15 XS2#14 XS4#9 XS6#4 XS7#4 XS8#4 XS9#3 XS12#3 XS13#2 XS14#4 XS14#5 XS15#3 XS17#3 XS18#3 XS19#3 XS20#2 XS21#2 XS22#2 XS23#3

### Nets
VSS: C1#4.2 XS01.5
Net?#2_9: ?#2.9 ?#3.9 ?#4.9 XS03#3.29(52)
Net?#2_10: ?#2.10 ?#3.10 ?#4.10 XS03#3.30(53)
NetC1#4_1: C1#4.1 XS17#3.9
NetD1#3_1: D1#3.1(A) P1#17.2(-)
NetD1#3_2: D1#3.2(K) P1#17.1(+)
NetP1#8_1: P1#8.1(+) XS2#8.3
NetP1#8_2: P1#8.2(-) P1#9.1(+)
NetP1#9_2: P1#9.2(-) P1#10.1(+)
NetP1#10_2: P1#10.2(-) XS2#8.4
NetP1#11_1: P1#11.1(+) XS2#9.3
NetP1#11_2: P1#11.2(-) P1#12.1(+)
NetP1#12_2: P1#12.2(-) P1#13.1(+)
NetP1#13_2: P1#13.2(-) XS2#9.4
NetP1#14_1: P1#14.1(+) XS2#10.3
NetP1#14_2: P1#14.2(-) P1#15.1(+)
NetP1#15_2: P1#15.2(-) P1#16.1(+)
NetP1#16_2: P1#16.2(-) XS2#10.4
NetP2#8_2: P2#8.2 XS1#9.3
NetP2#8_6: P2#8.6 XS1#9.2
NetP2#8_9: P2#8.9 XS1#9.1
NetP2#9_2: P2#9.2 XS1#9.6
NetP2#9_6: P2#9.6 XS1#9.5
NetP2#9_9: P2#9.9 XS1#9.4
NetP2#10_2: P2#10.2 XS1#9.9
NetP2#10_6: P2#10.6 XS1#9.8
NetP2#10_9: P2#10.9 XS1#9.7
NetP2#11_2: P2#11.2 XS1#10.3
NetP2#11_6: P2#11.6 XS1#10.2
NetP2#11_9: P2#11.9 XS1#10.1
NetP2#12_2: P2#12.2 XS1#10.6
NetP2#12_6: P2#12.6 XS1#10.5
NetP2#12_9: P2#12.9 XS1#10.4
NetP2#13_2: P2#13.2 XS1#10.9
NetP2#13_6: P2#13.6 XS1#10.8
NetP2#13_9: P2#13.9 XS1#10.7
NetP2#14_2: P2#14.2 XS1#11.3
NetP2#14_6: P2#14.6 XS1#11.2
NetP2#14_9: P2#14.9 XS1#11.1
NetP2#15_2: P2#15.2 XS1#11.6
NetP2#15_6: P2#15.6 XS1#11.5
NetP2#15_9: P2#15.9 XS1#11.4
NetP2#16_2: P2#16.2 XS1#11.9
NetP2#16_6: P2#16.6 XS1#11.8
NetP2#16_9: P2#16.9 XS1#11.7
NetP3#8_1: P3#8.1(L) P3#11.1(L) P3#14.1(L) XS01.1
NetP3#8_2: P3#8.2(N) P3#9.2(N) P3#10.2(N) P3#11.2(N) P3#12.2(N) P3#13.2(N) P3#14.2(N) P3#15.2(N) P3#16.2(N) XS01.4
NetP3#9_1: P3#9.1(L) P3#12.1(L) P3#15.1(L) XS01.2
NetP3#10_1: P3#10.1(L) P3#13.1(L) P3#16.1(L) XS01.3
NetXS1#12_1: XS1#12.1 XS1#13.1 XS1#14.1 XS1#15.1 XS03#1.2 XS23#3.7
NetXS1#12_3: XS1#12.3 XS1#13.3 XS1#14.3 XS1#15.4 XS03#1.3 XS03#1.4 XS23#3.6
NetXS2#11_1: XS2#11.1 XS2#12.1 XS2#13.1 XS17#3.8
NetXS2#11_2: XS2#11.2 XS7#4.1
NetXS2#11_3: XS2#11.3 XS7#4.2
NetXS2#11_4: XS2#11.4 XS7#4.3
NetXS2#11_5: XS2#11.5 XS7#4.4
NetXS2#12_2: XS2#12.2 XS8#4.1
NetXS2#12_3: XS2#12.3 XS8#4.2
NetXS2#12_4: XS2#12.4 XS8#4.3
NetXS2#12_5: XS2#12.5 XS8#4.4
NetXS2#13_2: XS2#13.2 XS9#3.1
NetXS2#13_3: XS2#13.3 XS9#3.2
NetXS2#13_4: XS2#13.4 XS9#3.3
NetXS2#13_5: XS2#13.5 XS9#3.4
NetXS2#14_1: XS2#14.1 XS03#1.15
NetXS2#14_2: XS2#14.2 XS03#1.14
NetXS2#14_3: XS2#14.3 XS03#1.13
NetXS2#14_4: XS2#14.4 XS03#1.12
NetXS2#14_5: XS2#14.5 XS03#1.11
NetXS2#14_6: XS2#14.6 XS03#1.10
NetXS02_1: XS02.1 XS2#8.2
NetXS02_2: XS02.2 XS2#8.1
NetXS02_3: XS02.3 XS2#9.2
NetXS02_4: XS02.4 XS2#9.1
NetXS02_5: XS02.5 XS2#10.2
NetXS02_6: XS02.6 XS2#10.1
NetXS03#1_5: XS03#1.5 XS13#2.1
NetXS03#1_6: XS03#1.6 XS13#2.2
NetXS03#1_7: XS03#1.7 XS13#2.3
NetXS03#1_8: XS03#1.8 XS13#2.4
NetXS03#1_9: XS03#1.9 XS13#2.5
NetXS03#2_1: XS03#2.1(34) XS14#5.4
NetXS03#2_2: XS03#2.2(35) XS14#5.6
NetXS03#2_3: XS03#2.3(36) XS14#5.8
NetXS03#2_4: XS03#2.4(37) XS14#5.10
NetXS03#3_1: XS03#3.1(16) XS12#3.3
NetXS03#3_2: XS03#3.2(17) XS12#3.5
NetXS03#3_3: XS03#3.3(18) XS12#3.7
NetXS03#3_4: XS03#3.4(19) XS12#3.9
NetXS03#3_5: XS03#3.5(20) XS12#3.4
NetXS03#3_6: XS03#3.6(21) XS12#3.1
NetXS03#3_7: XS03#3.7(22) XS12#3.12
NetXS03#3_8: XS03#3.8(23) XS12#3.2
NetXS03#3_9: XS03#3.9(24) XS12#3.10
NetXS03#3_10: XS03#3.10(25) XS12#3.6
NetXS03#3_11: XS03#3.11(26) XS12#3.11
NetXS03#3_12: XS03#3.12(27) XS12#3.8
NetXS03#3_13: XS03#3.13(28) XS4#9.1
NetXS03#3_14: XS03#3.14(29) XS4#9.2
NetXS03#3_15: XS03#3.15(30) XS4#9.3
NetXS03#3_16: XS03#3.16(31) XS4#9.4
NetXS03#3_17: XS03#3.17(32) XS4#9.5
NetXS03#3_18: XS03#3.18(33) XS4#9.6
NetXS03#3_23: XS03#3.23(38) XS15#3.1
NetXS03#3_24: XS03#3.24(39) XS15#3.2
NetXS03#3_25: XS03#3.25(40) XS15#3.3
NetXS4#6_1: XS4#6.1 XS17#3.4
NetXS4#6_2: XS4#6.2 XS17#3.1
NetXS4#6_3: XS4#6.3 XS14#4.1(12)
NetXS4#6_4: XS4#6.4 XS14#4.2(13)
NetXS4#6_5: XS4#6.5 XS4#7.5 XS4#8.5 XS17#3.7
NetXS4#7_1: XS4#7.1 XS17#3.5
NetXS4#7_2: XS4#7.2 XS17#3.2
NetXS4#7_3: XS4#7.3 XS14#4.3(14)
NetXS4#7_4: XS4#7.4 XS14#4.4(15)
NetXS4#8_1: XS4#8.1 XS17#3.6
NetXS4#8_2: XS4#8.2 XS17#3.3
NetXS4#8_3: XS4#8.3 XS14#4.5(16)
NetXS4#8_4: XS4#8.4 XS14#4.6(17)
NetXS04_1: XS04.1 XS21#2.2
NetXS04_2: XS04.2 XS21#2.1
NetXS04_3: XS04.3 XS04.13 XS22#2.4
NetXS04_4: XS04.4 XS22#2.3
NetXS04_5: XS04.5 XS23#3.1
NetXS04_6: XS04.6 XS23#3.2
NetXS04_7: XS04.7 XS22#2.7
NetXS04_8: XS04.8 XS23#3.5
NetXS04_9: XS04.9 XS22#2.2
NetXS04_10: XS04.10 XS22#2.6
NetXS04_11: XS04.11 XS23#3.4
NetXS04_12: XS04.12 XS23#3.3
NetXS04_14: XS04.14 XS21#2.3
NetXS04_15: XS04.15 XS22#2.5
NetXS04_16: XS04.16 XS22#2.1
NetXS5#4_1: XS5#4.1 XS18#3.1
NetXS5#4_2: XS5#4.2 XS18#3.2
NetXS5#4_3: XS5#4.3 XS18#3.3
NetXS5#4_4: XS5#4.4 XS18#3.4
NetXS5#4_5: XS5#4.5 XS18#3.5
NetXS5#5_1: XS5#5.1 XS19#3.1
NetXS5#5_2: XS5#5.2 XS19#3.2
NetXS5#5_3: XS5#5.3 XS19#3.3
NetXS5#5_4: XS5#5.4 XS19#3.4
NetXS5#5_5: XS5#5.5 XS19#3.5
NetXS5#6_1: XS5#6.1 XS20#2.1
NetXS5#6_2: XS5#6.2 XS20#2.2
NetXS5#6_3: XS5#6.3 XS20#2.3
NetXS5#6_4: XS5#6.4 XS20#2.4
NetXS5#6_5: XS5#6.5 XS20#2.5
NetXS05_1: XS05.1 XS6#4.1 XS6#4.2
NetXS05_2: XS05.2 XS6#4.3
NetXS05_3: XS05.3 XS6#4.5
NetXS05_4: XS05.4 XS6#4.7
NetXS05_5: XS05.5 XS6#4.10
NetXS05_6: XS05.6 XS6#4.9
NetXS05_7: XS05.7 XS6#4.4
NetXS05_8: XS05.8 XS6#4.8

Not connected (* = marked no-connect by the designer): P2#8 1 3 4 5 7 8 10 11 12; P2#9 1 3 4 5 7 8 10 11 12; P2#10 1 3 4 5 7 8 10 11 12; P2#11 1 3 4 5 7 8 10 11 12; P2#12 1 3 4 5 7 8 10 11 12; P2#13 1 3 4 5 7 8 10 11 12; P2#14 1 3 4 5 7 8 10 11 12; P2#15 1 3 4 5 7 8 10 11 12; P2#16 1 3 4 5 7 8 10 11 12; P2#17 1 2 3 4 5 6 7 8 9 10 11 12; P3#8 3(GND); P3#9 3(GND); P3#10 3(GND); P3#11 3(GND); P3#12 3(GND); P3#13 3(GND); P3#14 3(GND); P3#15 3(GND); P3#16 3(GND); P3#17 1(L) 2(N) 3(GND); XS1#12 2; XS1#13 2; XS1#14 2; XS1#15 2 3; XS03#1 1; XS03#3 19 20 21 22 26 27 28; XS04 17 18 19; XS4#9 7; XS05 9 10 11 12; XS6#4 6; XS14#5 1 2 3 5 7 9 11

### Notes on the sheet
- (near XS01) AC380V
- 机壳
- (near XS02) LD驱动
- (near XS01) 1 黄 2.5
- (near XS01) 2 绿 2.5
- (near XS01) 3 红 2.5
- (near XS01) 4 蓝 2.5
- (near XS01) 5 黄绿 0.5
- (near XS02) 6 R 2.5
- (near XS02) 7 B 2.5
- (near XS02) 8 R 2.5
- (near XS02) 9 B 2.5
- (near XS02) 10 R 2.5
- (near XS02) 11 B 2.5
- (near P3#8) 1 黄 2.5
- (near P3#9) 2 绿 2.5
- (near P3#10) 3 红 2.5
- (near P3#11) 1 黄 2.5
- (near P3#12) 2 绿 2.5
- (near P3#13) 3 红 2.5
- (near P3#14) 1 黄 2.5
- (near P3#15) 2 绿 2.5
- (near P3#16) 3 红 2.5
- (near P1#8) MW模块
- (near P1#9) MW模块
- MW模块
- (near P1#11) MW模块
- (near P1#12) MW模块
- (near P1#13) MW模块
- (near P1#14) MW模块
- (near P1#15) MW模块
- 备注：
  1：MW模块输出点需加装二极管，如图例所示；
  2：线号6-7、8-9、10-11，需要双绞；
- (near P1#8) 12   R 2.5
- (near P1#8) 13   R 2.5
- (near P1#9) 13   R 2.5
- (near P1#9) 14   R 2.5
- (near P1#10) 14   R 2.5
- (near P1#10) 15   B 2.5
- (near P1#11) 16   R 2.5
- (near P1#11) 17   R 2.5
- (near P1#12) 17   R 2.5
- (near P1#12) 18   R 2.5
- (near P1#13) 18   R 2.5
- (near P1#13) 19   B 2.5
- 4 蓝 2.5
- (near P1#14) 20   R 2.5
- (near P1#14) 21   R 2.5
- (near P1#15) 21   R 2.5
- (near P1#15) 22   R 2.5
- (near P1#16) 22   R 2.5
- (near P1#16) 23   B 2.5
- 7 B 2.5
- 6 R 2.5
- 9 B 2.5
- 8 R 2.5
- 16 R 2.5
- 19 B 2.5
- 11 B 2.5
- 10 R 2.5
- 20 R 2.5
- 23 B 2.5
- (near XS2#8) 12 R 2.5
- (near XS2#8) 15 B 2.5
- (near XS1#9) 24 紫 0.2
- (near XS1#9) 25 绿 0.2
- (near XS1#9) 26 灰 0.2
- (near XS1#9) 27 蓝 0.2
- (near XS1#9) 28 白 0.2
- (near XS1#9) 29 棕 0.2
- (near XS1#9) 30 黄 0.2
- (near XS1#9) 31 红 0.2
- (near XS1#9) 32 黑 0.2
- (near XS1#10) 33 紫 0.2
- (near XS1#10) 34 绿 0.2
- (near XS1#10) 35 灰 0.2
- (near XS1#10) 36 蓝 0.2
- (near XS1#10) 37 白 0.2
- (near XS1#10) 38 棕 0.2
- (near XS1#10) 39 黄 0.2
- (near XS1#10) 40 红 0.2
- (near XS1#10) 41 黑 0.2
- (near XS1#11) 42 紫 0.2
- (near XS1#11) 43 绿 0.2
- (near XS1#11) 44 灰 0.2
- (near XS1#11) 45 蓝 0.2
- (near XS1#11) 46 白 0.2
- (near XS1#11) 47 棕 0.2
- (near XS1#11) 48 黄 0.2
- (near XS1#11) 49 红 0.2
- (near XS1#11) 50 黑 0.2
- (near XS1#12) 51 红 0.2
- (near XS1#12) 52 黑 0.2
- (near XS4#6) 53 黑 0.2
- (near XS4#6) 54 棕 0.2
- (near XS4#6) 55 红 0.2
- (near XS4#6) 56 黄 0.2
- (near XS4#6) 57 蓝 0.2
- (near XS5#4) 58 蓝 0.2
- (near XS5#4) 59 绿 0.2
- (near XS5#4) 60 白 0.2
- (near XS5#4) 61 棕 0.2
- (near XS5#4) 62 黑 0.2
- (near XS2#11) 63 蓝 0.2
- (near XS2#11) 64 绿 0.2
- (near XS2#11) 65 紫 0.2
- (near XS2#11) 66 红 0.2
- (near XS2#11) 67 黑 0.2
- (near XS1#13) 51 红 0.2
- (near XS1#13) 52 黑 0.2
- (near XS4#7) 70 蓝 0.2
- (near XS4#7) 69 黄 0.2
- (near XS4#7) 128橙 0.2
- (near XS4#7) 129灰 0.2
- (near XS4#7) 53 黑 0.2
- (near XS5#5) 71 蓝 0.2
- (near XS5#5) 72 绿 0.2
- (near XS5#5) 73 白 0.2
- (near XS5#5) 74 棕 0.2
- (near XS5#5) 75 黑 0.2
- (near XS2#12) 76 蓝 0.2
- (near XS2#12) 77 绿 0.2
- (near XS2#12) 78 紫 0.2
- (near XS2#12) 79 红 0.2
- (near XS2#12) 67 黑 0.2
- (near XS1#14) 51 红 0.2
- (near XS1#14) 52 黑 0.2
- 53 黑 0.2
- (near XS4#8) 131白 0.2
- (near XS4#8) 130紫 0.2
- (near XS4#8) 82 黄 0.2
- (near XS4#8) 83 蓝 0.2
- (near XS5#6) 84 蓝 0.2
- (near XS5#6) 85 绿 0.2
- (near XS5#6) 86 白 0.2
- (near XS5#6) 87 棕 0.2
- (near XS5#6) 88 黑 0.2
- (near XS2#13) 89 蓝 0.2
- (near XS2#13) 90 绿 0.2
- (near XS2#13) 91 紫 0.2
- (near XS2#13) 92 红 0.2
- (near XS2#13) 67 黑 0.2
- (near XS7#4) 63 蓝 0.2
- (near XS7#4) 64 绿 0.2
- (near XS7#4) 65 紫 0.2
- (near XS7#4) 66 红 0.2
- (near XS17#3) 5 黄 0.2
- (near XS17#3) 67 黑 0.2
- (near XS17#3) 53 黑 0.2
- (near XS17#3) 83 蓝 0.2
- (near XS17#3) 70 蓝 0.2
- (near XS17#3) 57 蓝 0.2
- (near XS17#3) 82 黄 0.2
- (near XS17#3) 69 黄 0.2
- (near XS17#3) 56 黄 0.2
- (near XS14#4) 55 红 0.2
- (near XS14#4) 54 棕 0.2
- (near XS14#4) 128橙 0.2
- (near XS14#4) 129灰 0.2
- (near XS14#4) 130紫 0.2
- (near XS14#4) 131白 0.2
- (near XS20#2) 84 蓝 0.2
- (near XS20#2) 85 绿 0.2
- (near XS20#2) 86 白 0.2
- (near XS20#2) 87 棕 0.2
- (near XS20#2) 88 黑 0.2
- (near XS9#3) 89
- (near XS9#3) 90
- (near XS9#3) 91
- (near XS9#3) 92
- 52 黑 0.2
- (near XS03#1) 51 红 0.2
- (near XS1#15) 52 黑 0.2
- (near XS1#15) 51 红 0.2
- 163蓝 0.2
- 164绿 0.2
- 165黄 0.2
- (near XS23#3) 51 红 0.2
- (near XS23#3) 52 黑 0.2
- (near XS23#3) 100黄 0.2
- 159黑 0.2
- 160红 0.2
- 161黑 0.2
- 162紫 0.2
- 风扇1
- (near XS23#3) 97 蓝 0.2
- (near XS23#3) 98 绿 0.2
- (near XS23#3) 104紫 0.2
- (near XS23#3) 103绿 0.2
- 157棕 0.2
- 158橙 0.2
- 155灰 0.2
- 156蓝 0.2
- 风扇2
- (near XS21#2) 106黑 0.2
- (near XS21#2) 93 红 0.2
- (near XS21#2) 94 黑 0.2
- (near XS03#1) 控制1
- (near XS22#2) 108
- (near XS22#2) 101
- (near XS22#2) 96
- (near XS22#2) 105
- (near XS22#2) 107
- (near XS22#2) 102
- (near XS22#2) 99
- (near XS05) 109红 0.2
- (near XS05) 110绿 0.2
- (near XS05) 111蓝 0.2
- (near XS6#4) 115紫 0.2
- (near XS6#4) 111蓝 0.2
- (near XS6#4) 112灰 0.2
- (near XS6#4) 116黑 0.2
- (near XS6#4) 114橙 0.2
- (near XS6#4) 113黄 0.2
- (near XS14#5) 117棕 0.2
- (near XS14#5) 118紫 0.2
- (near XS14#5) 119红 0.2
- (near XS14#5) 120黄 0.2
- (near XS14#5) 121橙 0.2
- (near XS14#5) 122蓝 0.2
- (near XS14#5) 123紫 0.2
- (near XS14#5) 124白 0.2
- (near XS14#5) 125绿 0.2
- (near XS14#5) 126黑 0.2
- (near XS14#5) 127蓝 0.2
- (near XS12#3) 133红 0.2
- (near XS12#3) 134黑 0.2
- (near XS12#3) 135红 0.2
- (near XS12#3) 136黑 0.2
- (near XS12#3) 137黄 0.2
- (near XS12#3) 138黑 0.2
- (near XS12#3) 139绿 0.2
- (near XS12#3) 140黑 0.2
- (near XS12#3) 141蓝 0.2
- (near XS12#3) 142紫 0.2
- (near XS12#3) 143红 0.2
- (near XS12#3) 144黑 0.2
- (near XS4#9) 145红 0.2
- (near XS4#9) 146黑 0.2
- (near XS4#9) 147橙 0.2
- (near XS4#9) 148灰 0.2
- (near XS4#9) 149紫 0.2
- (near XS4#9) 150棕 0.2
- (near XS15#3) 152蓝 0.2
- (near XS15#3) 153绿 0.2
- (near XS15#3) 154黑 0.2
- 风扇3
- 13
- 控制2
- (near XS05) 112灰 0.2
- (near XS05) 113黄 0.2
- (near XS05) 114橙 0.2
- (near XS05) 115紫 0.2
- (near XS05) 116黑 0.2
- LD1工作
- LD1故障
- 166红 0.5
- 167黑 0.5
- (near XS04) 93 红 0.2
- (near XS04) 94 黑 0.2
- (near XS04) 105红 0.2
- (near XS04) 96 棕 0.2
- (near XS04) 97 蓝 0.2
- (near XS04) 98 绿 0.2
- (near XS04) 99 灰 0.2
- (near XS04) 100黄 0.2
- (near XS04) 101白 0.2
- (near XS04) 102橙 0.2
- (near XS04) 103绿 0.2
- (near XS04) 104紫 0.2
- (near XS04) 106黑 0.2
- (near XS04) 107蓝 0.2
- (near XS04) 108黑 0.2
- LD2工作
- LD2故障
- (near XS03#2) 120
- (near XS03#2) 122
- (near XS03#2) 124
- (near XS03#2) 126
- (near XS03#3) 135
- (near XS03#3) 137
- (near XS03#3) 139
- (near XS03#3) 141
- (near XS03#3) 136
- (near XS03#3) 133
- (near XS03#3) 144
- (near XS03#3) 134
- (near XS03#3) 142
- (near XS03#3) 138
- (near XS03#3) 143
- (near XS03#3) 140
- (near XS03#3) 145
- (near XS03#3) 146
- (near XS03#3) 147
- (near XS03#3) 148
- (near XS03#3) 149
- (near XS03#3) 150
- (near XS03#3) 152
- (near XS03#3) 153
- (near XS03#3) 154
- (near XS03#3) 控制1
- (near XS04) 机床控制
- LD3工作
- LD3故障
- (near XS03#2) 控制1

### Library data of the parts
?#2-?#4 = FAN1
C1#4 = Cap: Capacitor; Published: 8-Jun-2000; LatestRevisionDate: 17-Jul-2002; LatestRevisionNote: Re-released for DXP Platform.; PackageReference: RAD-0.3; Publisher: Altium Limited
D1#3 = Diode 1N5407: 3 Amp Medium Power Silicon Rectifier Diode; Published: 8-Jun-2000; LatestRevisionDate: 17-Jul-2002; LatestRevisionNote: Re-released for DXP Platform.; DatasheetVersion: Aug-1984; PackageReference: DO-201AD; Publisher: Altium Limited; ComponentLink1Description: Manufacturer Link; ComponentLink1URL: http://www.irf.com/
P1#8-P1#17 = Header 2: Header, 2-Pin; LatestRevisionDate: 17-Jul-2002; LatestRevisionNote: Re-released for DXP Platform.; Publisher: Altium Limited
P2#8-P2#17 = Header 6X2H: Header, 6-Pin, Dual row, Right Angle; LatestRevisionDate: 17-Jul-2002; LatestRevisionNote: Re-released for DXP Platform.; Publisher: Altium Limited
P3#8-P3#17 XS1#12-XS1#14 XS15#3 XS21#2 = Header 3: Header, 3-Pin; LatestRevisionDate: 17-Jul-2002; LatestRevisionNote: Re-released for DXP Platform.; Publisher: Altium Limited
XS01 XS2#11-XS2#13 XS4#6-XS4#8 XS5#4-XS5#6 XS13#2 XS18#3 XS19#3 XS20#2 = Header 5: Header, 5-Pin; LatestRevisionDate: 17-Jul-2002; LatestRevisionNote: Re-released for DXP Platform.; Publisher: Altium Limited
XS1#9-XS1#11 XS17#3 = Header 9: Header, 9-Pin; LatestRevisionDate: 17-Jul-2002; LatestRevisionNote: Re-released for DXP Platform.; Publisher: Altium Limited
XS1#15 XS2#8-XS2#10 XS03#2 XS7#4 XS8#4 XS9#3 = Header 4: Header, 4-Pin; LatestRevisionDate: 17-Jul-2002; LatestRevisionNote: Re-released for DXP Platform.; Publisher: Altium Limited
XS02 XS2#14 XS14#4 = Header 6: Header, 6-Pin; LatestRevisionDate: 17-Jul-2002; LatestRevisionNote: Re-released for DXP Platform.; Publisher: Altium Limited
XS03#1 = Header 15: Header, 15-Pin; LatestRevisionDate: 17-Jul-2002; LatestRevisionNote: Re-released for DXP Platform.; Publisher: Altium Limited
XS03#3 = Header 30: Header, 30-Pin; LatestRevisionDate: 17-Jul-2002; LatestRevisionNote: Re-released for DXP Platform.; Publisher: Altium Limited
XS04 = Header 19: Header, 19-Pin; LatestRevisionDate: 17-Jul-2002; LatestRevisionNote: Re-released for DXP Platform.; Publisher: Altium Limited
XS4#9 XS22#2 XS23#3 = Header 7: Header, 7-Pin; LatestRevisionDate: 17-Jul-2002; LatestRevisionNote: Re-released for DXP Platform.; Publisher: Altium Limited
XS05 XS12#3 = Header 12: Header, 12-Pin; LatestRevisionDate: 17-Jul-2002; LatestRevisionNote: Re-released for DXP Platform.; Publisher: Altium Limited
XS6#4 = Header 10: Header, 10-Pin; LatestRevisionDate: 17-Jul-2002; LatestRevisionNote: Re-released for DXP Platform.; Publisher: Altium Limited
XS14#5 = Header 11: Header, 11-Pin; LatestRevisionDate: 17-Jul-2002; LatestRevisionNote: Re-released for DXP Platform.; Publisher: Altium Limited

## Sheet 驱动.SchDoc
size A4; PageSetup: Record=PageOptions|CenterHorizontal=True|CenterVertical=True|PrintScale=0.97|XCorrection=1.00|YCorrection=1.00|PrintKind=1|BorderSize=5000000|LeftOffset=0|BottomOffset=0|Orientation=2|PaperLength=1000|PaperWidth=1000|Scale=100|PaperSource=15|PrintQuality=600|MediaType=1|DitherType=10|PaperKind=A3|PrintScaleMode=1
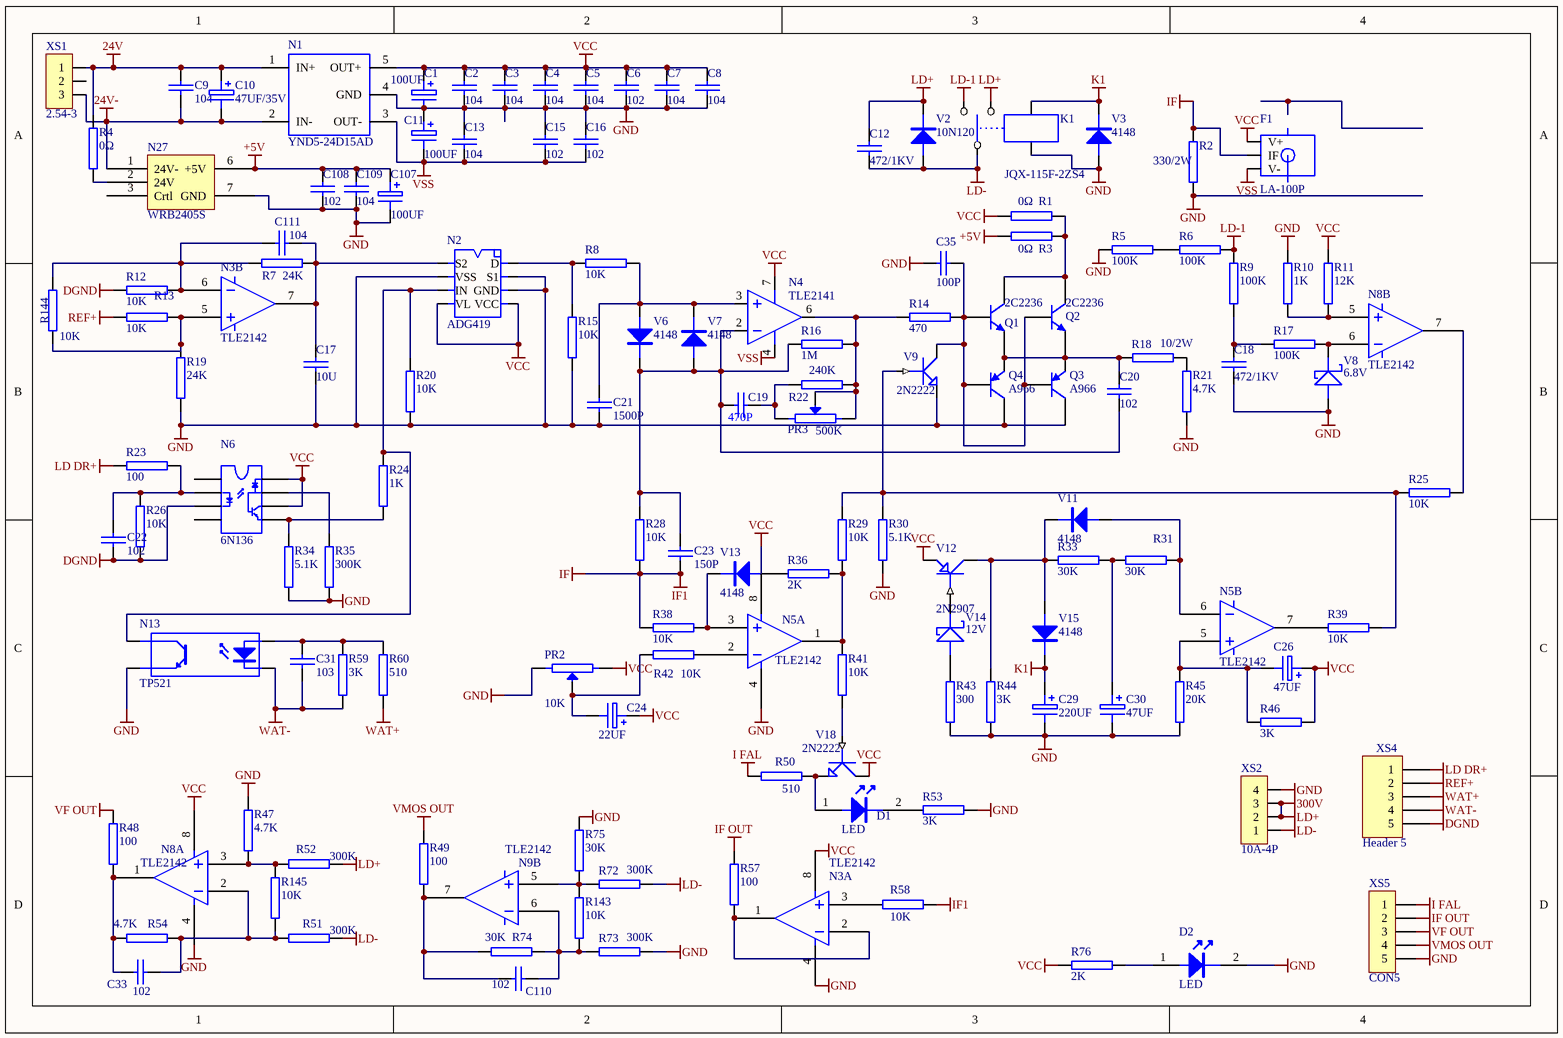
[diagram p7: 驱动.SchDoc]

### Parts
(Parts that share a designator on the sheet are numbered #1, #2 ... from top to bottom, then left to right.)
C1#5  100UF  [RB.1/.2]
C2#3  104  [0805A]
C3#3  104  [0805A]
C4#3  104  [0805A]
C5#3  104  [0805A]
C6#3  102  [0805A]
C7#3  104  [0805A]
C8#3  104  [0805A]
C9#3  104  [1206]
C10#3  47UF/35V  [RB.1/.2]
C11#3  100UF  [RB.1/.2]
C12#3  472/1KV  [RAD0.3]
C13#3  104  [0805A]
C15#3  102  [0805A]
C16#3  102  [0805A]
C17#3  10U  [0805A]
C18#3  472/1KV  [RAD0.2]
C19#3  470P  [0805A]
C20#3  102  [1206]
C21#3  1500P  [0805A]
C22#3  102  [0805A]
C23#3  150P  [0805A]
C24#3  22UF  [1206]
C26#3  47UF  [RB.1/.2]
C29#3  220UF  [RB.1/.2]
C30#3  47UF  [RB.1/.2]
C31#3  103  [0805A]
C33#3  102  [0805A]
C35#3  100P  [1206]
C107  100UF  [RB.1/.2]
C108  102  [0805]
C109  104  [0805]
C110  102  [0805A]
C111  104  [0805]
D1#4  LED  [1206A]
D2#2  LED  [1206a]
F1  LA-100P  [IF-1]
K1  JQX-115F-2ZS4  [JQX-115F]
N1#2  YND5-24D15AD  [YND5-D]
N2#3  ADG419  [SO-8]
N3#3  TLE2142  [SO-8]  (parts A,B of 2)
N4#3  TLE2141  [SO-8]
N5#3  TLE2142  [SO-8]  (parts A,B of 2)
N6#3  6N136  [DIP8]
N8#3  TLE2142  [SO-8]  (parts A,B of 2)
N9#3  TLE2142  [SO-8]  (part B of 2)
N13#3  TP521  [DIP4]
N27  WRB2405S  [WRB2405S]
PR2#2  10K  [3224]
PR3#2  500K  [3224]
Q1  2C2236  [TO-92_2]
Q2  2C2236  [TO-92_2]
Q3  A966  [TO-92_2]
Q4  A966  [TO-92_2]
R1#3  0Ω  [1206]
R2#3  330/2W  [AXIAL0.7]
R3#3  0Ω  [1206]
R4#3  0Ω  [0805A]
R5#3  100K  [1206]
R6#2  100K  [1206]
R7#3  24K  [0805A]
R8#3  10K  [0805A]
R9#3  100K  [1206]
R10#3  1K  [0805A]
R11#3  12K  [0805A]
R12#3  10K  [0805A]
R13#3  10K  [0805A]
R14#3  470  [0805A]
R15#3  10K  [0805A]
R16#3  1M  [0805A]
R17#3  100K  [1206]
R18#3  10/2W  [2W]
R19#3  24K  [0805A]
R20#3  10K  [0805A]
R21#3  4.7K  [0805A]
R22#3  240K  [0805A]
R23#3  100  [0805A]
R24#3  1K  [0805A]
R25#3  10K  [0805A]
R26#3  10K  [0805A]
R28#3  10K  [0805A]
R29#3  10K  [0805A]
R30#3  5.1K  [0805A]
R31#3  30K  [0805A]
R33#3  30K  [0805A]
R34#3  5.1K  [0805A]
R35#3  300K  [0805A]
R36#3  2K  [0805A]
R38#3  10K  [0805A]
R39#3  10K  [0805A]
R41#3  10K  [0805A]
R42#3  10K  [0805A]
R43#3  300  [0805A]
R44#3  3K  [0805A]
R45#3  20K  [0805A]
R46#3  3K  [0805A]
R47#3  4.7K  [0805A]
R48#3  100  [0805A]
R49#3  100  [0805]
R50#3  510  [0805A]
R51#3  300K  [1206]
R52#3  300K  [1206]
R53#3  3K  [0805A]
R54#3  4.7K  [0805A]
R57#3  100  [0805A]
R58#3  10K  [0805A]
R59#3  3K  [0805A]
R60#3  510  [0805A]
R72#2  300K  [1206]
R73#3  300K  [1206]
R74#3  30K  [0805]
R75#3  30K  [0805]
R76#3  2K  [0805]
R143  10K  [0805A]
R144  10K  [0805A]
R145  10K  [0805]
V2#3  10N120  [TO220D1]
V3#2  4148  [1206-D]
V6#2  4148  [1206-D]
V7#3  4148  [1206-D]
V8#2  6.8V  [1206-D]
V9#2  2N2222  [SOT-23]
V11#2  4148  [1206-D]
V12#2  2N2907  [SOT-23]
V13#2  4148  [1206-D]
V14#2  12V  [1206-D]
V15#2  4148  [1206-D]
V18#2  2N2222  [SOT-23]
XS1#16  2.54-3  [SIP3]
XS2#15  10A-4P  [XS10A-4P]
XS4#10  Header 5  [SIP-5]
XS5#7  CON5  [SIP-5]

### Nets
24V: C9#3.1 C10#3.1 N1#2.1(IN+) R4#3.1 XS1#16.1
24V-: C9#3.2 C10#3.2 N1#2.2(IN-) N27.1(24V-) XS1#16.3
300V: C12#3.1 K1.3 R52#3.2 V2#3.K XS2#15.2 XS2#15.3  [also labelled LD+]
+5V: C1#5.1 C2#3.1 C3#3.1 C4#3.1 C5#3.1 C6#3.1 C7#3.1 C8#3.1 C24#3.1 C26#3.1 C107.1 C108.1 C109.1 F1.3(V+) N1#2.5(OUT+) N2#3.4(VCC) N2#3.5(VL) N3#3.8 N4#3.7(V+) N5#3.8 N6#3.6(VO) N6#3.8(VCC) N8#3.8 N27.6(+5V) PR2#2.2 R1#3.1 R3#3.1 R11#3.2 R46#3.1 R76#3.1 V12#2.E V18#2.C  [also labelled VCC]
DGND: C22#3.1 N6#3.3(IN-) R12#3.2 R26#3.1 XS4#10.5
GND: C2#3.2 C3#3.2 C4#3.2 C5#3.2 C6#3.2 C7#3.2 C8#3.2 C11#3.1 C13#3.1 C15#3.1 C16#3.1 C17#3.2 C18#3.2 C21#3.2 C29#3.2 C30#3.2 C35#3.1 C107.2 C108.2 C109.2 D2#2.2 K1.4 N1#2.4(GND) N2#3.2(S1) N2#3.3(GND) N2#3.7(VSS) N3#3.4 N5#3.4 N8#3.4 N13#3.E N27.7(GND) PR2#2.1 Q3.1(C) Q4.1(C) R2#3.1 R5#3.1 R10#3.2 R15#3.1 R19#3.2 R20#3.1 R21#3.2 R30#3.2 R34#3.1 R35#3.1 R43#3.1 R44#3.2 R45#3.1 R47#3.2 R53#3.1 R73#3.2 R75#3.1 V3#2.A V8#2.A V9#2.E XS2#15.4
I FAL: R50#3.2
IF: C23#3.1 F1.4(IF) R2#3.2 R28#3.1 R38#3.2 R58#3.2  [also labelled IF1]
IF OUT: R57#3.1
K1: C29#3.1 K1.5 V3#2.K V15#2.K
LD DR+: R23#3.2 XS4#10.1
LD-: C12#3.2 K1.1 R51#3.2 R72#2.2 V2#3.A XS2#15.1
LD-1: K1.2 R6#2.2 R9#3.2
REF+: R13#3.2 XS4#10.2
VF OUT: R48#3.1
VMOS OUT: R49#3.1
VSS: C11#3.2 C13#3.2 C15#3.2 C16#3.2 F1.5(V-) N1#2.3(OUT-) N4#3.4(V-)
WAT+: R60#3.1 XS4#10.3
WAT-: C31#3.1 N13#3.K R59#3.2 XS4#10.4
NetC17#3_1: C17#3.1 C111.2 N2#3.8(S2) N3#3.7 R7#3.1
NetC18#3_1: C18#3.1 R9#3.1 R17#3.2
NetC19#3_1: C19#3.1 PR3#2.1 R22#3.2
NetC19#3_2: C19#3.2 C20#3.2 C23#3.2 N4#3.2(IN-) R16#3.2 R28#3.2 V6#2.K V7#3.A
NetC20#3_1: C20#3.1 Q1.3(E) Q2.3(E) Q3.3(E) Q4.3(E) R18#3.1
NetC21#3_1: C21#3.1 N4#3.3(IN+) R8#3.1 V6#2.A V7#3.K
NetC22#3_2: C22#3.2 N6#3.2(IN+) R23#3.1 R26#3.2
NetC24#3_2: C24#3.2 PR2#2.W R42#3.2
NetC26#3_2: C26#3.2 N5#3.5 R45#3.2 R46#3.2
NetC30#3_1: C30#3.1 R31#3.2 R33#3.1
NetC31#3_2: C31#3.2 N13#3.A R59#3.1 R60#3.2
NetC33#3_1: C33#3.1 N8#3.2 R51#3.1 R54#3.1 R145.2
NetC33#3_2: C33#3.2 N8#3.1 R48#3.2 R54#3.2
NetC35#3_2: C35#3.2 Q1.2(B) Q2.2(B) Q3.2(B) Q4.2(B) R14#3.1 V9#2.C
NetC110_1: C110.1 N9#3.6 R73#3.1 R74#3.1 R143.2
NetC110_2: C110.2 N9#3.7 R49#3.2 R74#3.2
NetC111_1: C111.1 N3#3.6 R7#3.2 R12#3.1 R144.1
NetD1#4_1: D1#4.1 R50#3.1 V18#2.E
NetD1#4_2: D1#4.2 R53#3.2
NetD2#2_1: D2#2.1 R76#3.2
NetN2#3_1: N2#3.1(D) R8#3.2 R15#3.2
NetN2#3_6: N2#3.6(IN) N13#3.C R20#3.2 R24#3.2
NetN3#3_1: N3#3.1 N3#3.2 R57#3.2
NetN3#3_3: N3#3.3 R58#3.1
NetN3#3_5: N3#3.5 R13#3.1 R19#3.1 R144.2
NetN4#3_6: N4#3.6(OUT) PR3#2.2 PR3#2.W R14#3.2 R16#3.1 R22#3.1
NetN5#3_1: N5#3.1 R29#3.2 R36#3.2 R41#3.2
NetN5#3_2: N5#3.2 R42#3.1
NetN5#3_3: N5#3.3 R38#3.1 V13#2.K
NetN5#3_6: N5#3.6 R31#3.1 V11#2.A
NetN5#3_7: N5#3.7 R39#3.1
NetN6#3_5: N6#3.5(GND) R24#3.1 R34#3.2
NetN6#3_7: N6#3.7(VB) R35#3.2
NetN8#3_3: N8#3.3 R47#3.1 R52#3.1 R145.1
NetN8#3_5: N8#3.5 R10#3.1 R11#3.1
NetN8#3_6: N8#3.6 R17#3.1 V8#2.K
NetN8#3_7: N8#3.7 R25#3.1
NetN9#3_5: N9#3.5 R72#2.1 R75#3.2 R143.1
NetN27_2: N27.2(24V) R4#3.2
NetQ1_1: Q1.1(C) Q2.1(C) R1#3.2 R3#3.2
NetR5#3_2: R5#3.2 R6#2.1
NetR18#3_0: R18#3.0 R21#3.1
NetR25#3_2: R25#3.2 R29#3.1 R30#3.1 R39#3.2 V9#2.B
NetR33#3_2: R33#3.2 R44#3.1 V11#2.K V12#2.C V15#2.A
NetR36#3_1: R36#3.1 V13#2.A
NetR41#3_1: R41#3.1 V18#2.B
NetR43#3_2: R43#3.2 V14#2.A
NetV12#2_B: V12#2.B V14#2.K

Not connected (* = marked no-connect by the designer): C1#5 2; N6#3 1(NC) 4(NC); N27 3(Crtl); XS1#16 2; XS5#7 1 2 3 4 5

### Notes on the sheet
- Labels drawn without touching a wire or pin: GND, I FAL, IF OUT, VF OUT, VMOS OUT

### Library data of the parts
C1#5 C10#3 C11#3 C24#3 C26#3 C29#3 C30#3 C107 = ELECTRO1
C2#3 C3#3 C4#3 C5#3 C6#3 C7#3 C8#3 C9#3 C12#3 C13#3 C15#3 C16#3 C17#3 C18#3 C19#3 C20#3 C21#3 C22#3 C23#3 C31#3 C33#3 C35#3 C108-C111 = CAP
F1 = IF-1
K1 = RELAY-SPDT
N1#2 = YND5
N3#3 N5#3 N8#3 N9#3 = LM193
N4#3 = TLC2241
N6#3 = 6N137
N13#3 = OPTOISO1
PR2#2 PR3#2 = POT
Q1 Q2 = 2N3904: NPN General Purpose Amplifier; Published: 8-Jun-2000; LatestRevisionDate: 15-Jan-2003; LatestRevisionNote: PCB Footprint 'BCY-W3/D4.7' replaced; DatasheetVersion: 1997; PackageVersion: Sep-1998; PackageReference: TO-92A; Publisher: Altium Limited; Code_JEDEC: TO-92A; ComponentLink1Description: Manufacturer Link; ComponentLink1URL: http://www.fairchildsemi.com/; ComponentLink2Description: Datasheet; ComponentLink2URL: http://www.fairchildsemi.com/ds/2N%2F2N3904.pdf
Q3 Q4 = 2N3906: PNP General Purpose Amplifier; Published: 8-Jun-2000; LatestRevisionDate: 15-Jan-2003; LatestRevisionNote: PCB Footprint 'BCY-W3/D4.7' replaced; DatasheetVersion: 1997; PackageVersion: Sep-1998; PackageReference: TO-92A; Publisher: Altium Limited; Code_JEDEC: TO-92A; ComponentLink1Description: Manufacturer Link; ComponentLink1URL: http://www.fairchildsemi.com/; ComponentLink2Description: Datasheet; ComponentLink2URL: http://www.fairchildsemi.com/ds/2N%2F2N3906.pdf
R1#3 R2#3 R3#3 R4#3 R5#3 R6#2 R7#3 R8#3 R9#3 R10#3 R11#3 R12#3 R13#3 R14#3 R15#3 R16#3 R17#3 R18#3 R19#3 R20#3 R21#3 R22#3 R23#3 R24#3 R25#3 R26#3 R28#3 R29#3 R30#3 R31#3 R33#3 R34#3 R35#3 R36#3 R38#3 R39#3 R41#3 R42#3 R43#3 R44#3 R45#3 R46#3 R47#3 R48#3 R49#3 R50#3 R51#3 R52#3 R53#3 R54#3 R57#3 R58#3 R59#3 R60#3 R72#2 R73#3 R74#3 R75#3 R76#3 R143-R145 = RES2
V2#3 V3#2 V6#2 V7#3 V11#2 V13#2 V15#2 = DIODE
V8#2 V14#2 = DIODE SCHOTTKY
V9#2 V18#2 = NPN1
V12#2 = PNP2
XS1#16 = CON3
XS2#15 = CON4
XS4#10 = Header 5: Header, 5-Pin; LatestRevisionDate: 17-Jul-2002; LatestRevisionNote: Re-released for DXP Platform.; Publisher: Altium Limited
XS5#7 = CON5: Connector

## Sheet 电源调压板.SchDoc
size A4; PageSetup: Record=PageOptions|CenterHorizontal=True|CenterVertical=True|PrintScale=0.97|XCorrection=1.00|YCorrection=1.00|PrintKind=1|BorderSize=5000000|LeftOffset=0|BottomOffset=0|Orientation=2|PaperLength=1000|PaperWidth=1000|Scale=100|PaperSource=15|PrintQuality=600|MediaType=1|DitherType=10|PaperKind=A3|PrintScaleMode=1
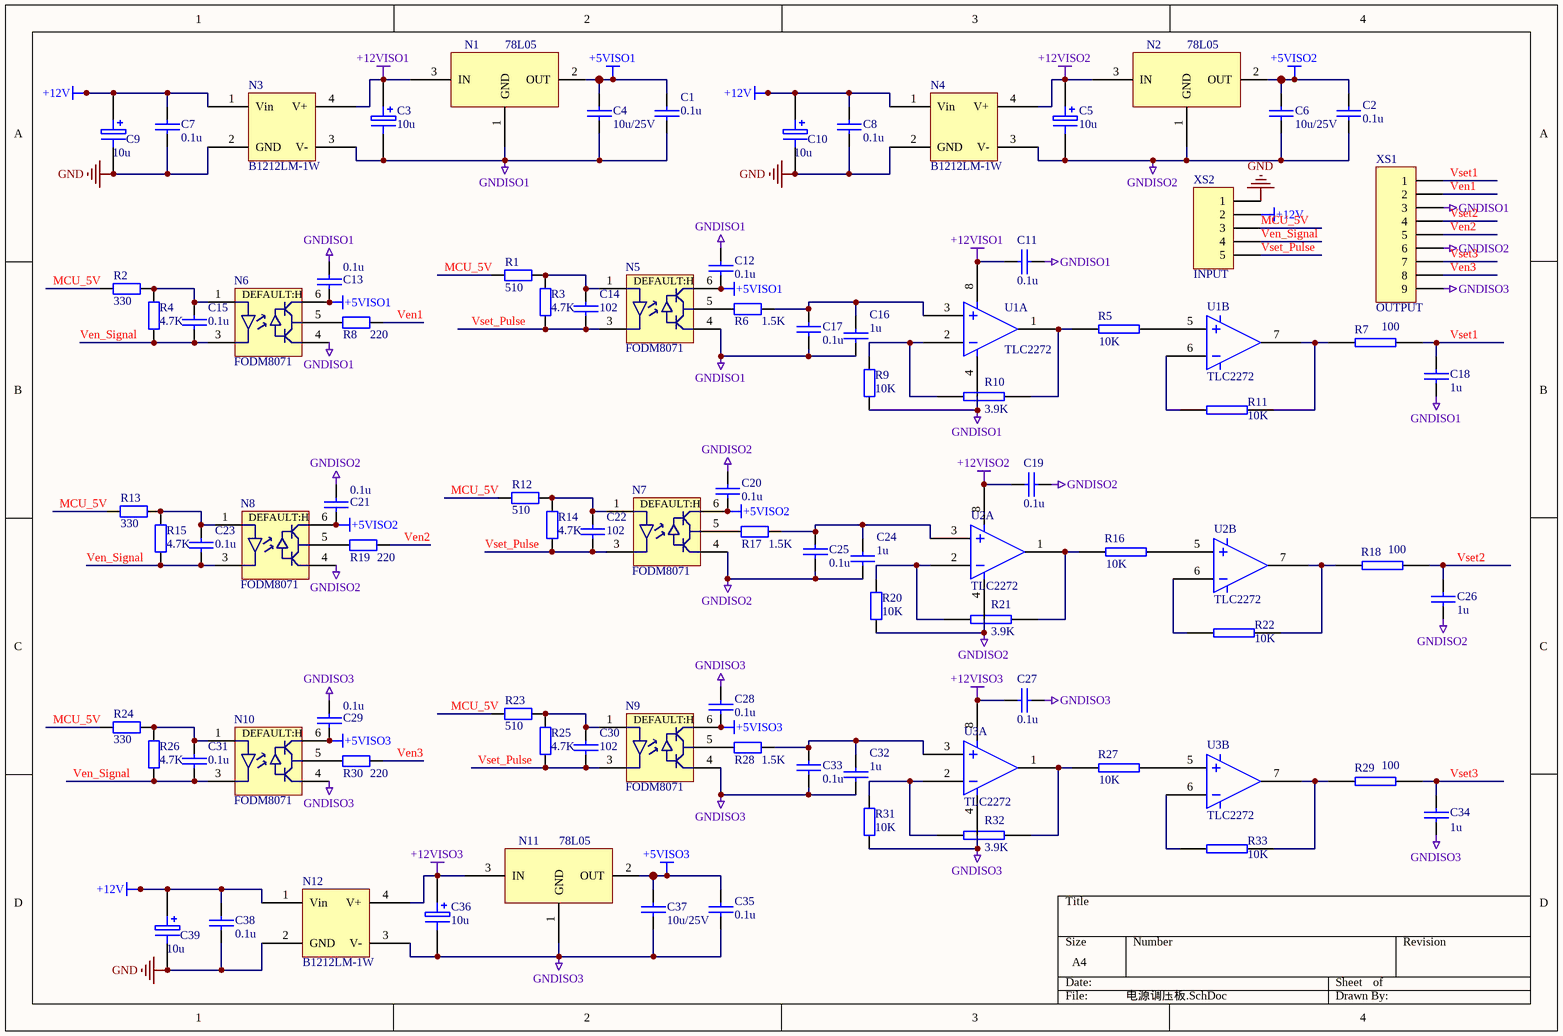
[diagram p8: 电源调压板.SchDoc]

### Parts
(Parts that share a designator on the sheet are numbered #1, #2 ... from top to bottom, then left to right.)
C1#6  0.1u  [0805]
C2#4  0.1u  [0805]
C3#4  10u  [1206]
C4#4  10u/25V  [1206]
C5#4  10u  [1206]
C6#4  10u/25V  [1206]
C7#4  0.1u  [0805]
C8#4  0.1u  [0805]
C9#4  10u  [1206]
C10#4  10u  [1206]
C11#4  0.1u  [0805]
C12#4  0.1u  [0805]
C13#4  0.1u  [0805]
C14#2  102  [0805]
C15#4  0.1u  [0805]
C16#4  1u  [0805]
C17#4  0.1u  [0805]
C18#4  1u  [0805]
C19#4  0.1u  [0805]
C20#4  0.1u  [0805]
C21#4  0.1u  [0805]
C22#4  102  [0805]
C23#4  0.1u  [0805]
C24#4  1u  [0805]
C25#3  0.1u  [0805]
C26#4  1u  [0805]
C27#3  0.1u  [0805]
C28#3  0.1u  [0805]
C29#4  0.1u  [0805]
C30#4  102  [0805]
C31#4  0.1u  [0805]
C32#3  1u  [0805]
C33#4  0.1u  [0805]
C34#3  1u  [0805]
C35#4  0.1u  [0805]
C36#3  10u  [1206]
C37#3  10u/25V  [1206]
C38#3  0.1u  [0805]
C39#3  10u  [1206]
N1#3  78L05  [TO-92_2]
N2#4  78L05  [TO-92_2]
N3#4  B1212LM-1W  [B0505LS]
N4#4  B1212LM-1W  [B0505LS]
N5#4  FODM8071  [SO-6]
N6#4  FODM8071  [SO-6]
N7#3  FODM8071  [SO-6]
N8#4  FODM8071  [SO-6]
N9#4  FODM8071  [SO-6]
N10#3  FODM8071  [SO-6]
N11#3  78L05  [TO-92_2]
N12#3  B1212LM-1W  [B0505LS]
R1#4  510  [1206]
R2#4  330  [1206]
R3#4  4.7K  [0805]
R4#4  4.7K  [0805]
R5#4  10K  [0805]
R6#3  1.5K  [0805]
R7#4  100  [0805]
R8#4  220  [0805]
R9#4  10K  [0805]
R10#4  3.9K  [0805]
R11#4  10K  [0805]
R12#4  510  [1206]
R13#4  330  [1206]
R14#4  4.7K  [0805]
R15#4  4.7K  [0805]
R16#4  10K  [0805]
R17#4  1.5K  [0805]
R18#4  100  [0805]
R19#4  220  [0805]
R20#4  10K  [0805]
R21#4  3.9K  [0805]
R22#4  10K  [0805]
R23#4  510  [1206]
R24#4  330  [1206]
R25#4  4.7K  [0805]
R26#4  4.7K  [0805]
R27#3  10K  [0805]
R28#4  1.5K  [0805]
R29#4  100  [0805]
R30#4  220  [0805]
R31#4  10K  [0805]
R32#3  3.9K  [0805]
R33#4  10K  [0805]
U1#3  TLC2272  [SO-8]  (parts A,B of 2)
U2#2  TLC2272  [SO-8]  (parts A,B of 2)
U3#1  TLC2272  [SO-8]  (part B of 2)
U3#2  TLC2272  [SO-8]  (part A of 2)
XS1#17  OUTPUT  [sip-9]
XS2#16  INPUT  [sip-5]

### Nets
+5VISO1: C1#6.1 C4#4.1 C12#4.1 C13#4.1 N1#3.2(OUT) N5#4.6(VDD) N6#4.6(VDD)
+5VISO2: C2#4.1 C6#4.1 C20#4.1 C21#4.1 N2#4.2(OUT) N7#3.6(VDD) N8#4.6(VDD)
+5VISO3: C28#3.1 C29#4.1 C35#4.1 C37#3.1 N9#4.6(VDD) N10#3.6(VDD) N11#3.2(OUT)
+12V: C7#4.1 C8#4.1 C9#4.1 C10#4.1 C38#3.1 C39#3.1 N3#4.1(Vin) N4#4.1(Vin) N12#3.1(Vin) XS2#16.2
+12VISO1: C3#4.1 C11#4.1 N1#3.3(IN) N3#4.4(V+) U1#3.8
+12VISO2: C5#4.1 C19#4.1 N2#4.3(IN) N4#4.4(V+) U2#2.8
+12VISO3: C27#3.1 C36#3.1 N11#3.3(IN) N12#3.4(V+) U3#2.8
GND: C7#4.2 C8#4.2 C9#4.2 C10#4.2 C38#3.2 C39#3.2 N3#4.2(GND) N4#4.2(GND) N12#3.2(GND) XS2#16.1
GNDISO1: C1#6.2 C3#4.2 C4#4.2 C11#4.2 C12#4.2 C13#4.2 C16#4.1 C17#4.1 C18#4.2 N1#3.1(GND) N3#4.3(V-) N5#4.4(GND) N6#4.4(GND) R9#4.1 U1#3.4 XS1#17.3  [project net DGND]
GNDISO2: C2#4.2 C5#4.2 C6#4.2 C19#4.2 C20#4.2 C21#4.2 C24#4.1 C25#3.1 C26#4.2 N2#4.1(GND) N4#4.3(V-) N7#3.4(GND) N8#4.4(GND) R20#4.1 U2#2.4 XS1#17.6
GNDISO3: C27#3.2 C28#3.2 C29#4.2 C32#3.1 C33#4.1 C34#3.2 C35#4.2 C36#3.2 C37#3.2 N9#4.4(GND) N10#3.4(GND) N11#3.1(GND) N12#3.3(V-) R31#4.1 U3#2.4 XS1#17.9
MCU_5V: R1#4.2 R2#4.2 R12#4.2 R13#4.2 R23#4.2 R24#4.2 XS2#16.3
Ven1: R8#4.1 XS1#17.2
Ven2: R19#4.1 XS1#17.5
Ven3: R30#4.1 XS1#17.8
Ven_Signal: C15#4.1 C23#4.1 C31#4.1 N6#4.3(IN-) N8#4.3(IN-) N10#3.3(IN-) R4#4.2 R15#4.2 R26#4.2 XS2#16.4
Vset1: C18#4.1 R7#4.2 XS1#17.1
Vset2: C26#4.1 R18#4.2 XS1#17.4
Vset3: C34#3.1 R29#4.2 XS1#17.7
Vset_Pulse: C14#2.1 C22#4.1 C30#4.1 N5#4.3(IN-) N7#3.3(IN-) N9#4.3(IN-) R3#4.2 R14#4.2 R25#4.2 XS2#16.5
NetC14#2_2: C14#2.2 N5#4.1(IN+) R1#4.1 R3#4.1
NetC15#4_2: C15#4.2 N6#4.1(IN+) R2#4.1 R4#4.1
NetC16#4_2: C16#4.2 C17#4.2 R6#3.1 U1#3.3
NetC22#4_2: C22#4.2 N7#3.1(IN+) R12#4.1 R14#4.1
NetC23#4_2: C23#4.2 N8#4.1(IN+) R13#4.1 R15#4.1
NetC24#4_2: C24#4.2 C25#3.2 R17#4.1 U2#2.3
NetC30#4_2: C30#4.2 N9#4.1(IN+) R23#4.1 R25#4.1
NetC31#4_2: C31#4.2 N10#3.1(IN+) R24#4.1 R26#4.1
NetC32#3_2: C32#3.2 C33#4.2 R28#4.1 U3#2.3
NetN5#4_5: N5#4.5(VO) R6#3.2
NetN6#4_5: N6#4.5(VO) R8#4.2
NetN7#3_5: N7#3.5(VO) R17#4.2
NetN8#4_5: N8#4.5(VO) R19#4.2
NetN9#4_5: N9#4.5(VO) R28#4.2
NetN10#3_5: N10#3.5(VO) R30#4.2
NetR5#4_1: R5#4.1 R10#4.2 U1#3.1
NetR5#4_2: R5#4.2 U1#3.5
NetR7#4_1: R7#4.1 R11#4.2 U1#3.7
NetR9#4_2: R9#4.2 R10#4.1 U1#3.2
NetR11#4_1: R11#4.1 U1#3.6
NetR16#4_1: R16#4.1 R21#4.2 U2#2.1
NetR16#4_2: R16#4.2 U2#2.5
NetR18#4_1: R18#4.1 R22#4.2 U2#2.7
NetR20#4_2: R20#4.2 R21#4.1 U2#2.2
NetR22#4_1: R22#4.1 U2#2.6
NetR27#3_1: R27#3.1 R32#3.2 U3#2.1
NetR27#3_2: R27#3.2 U3#1.5
NetR29#4_1: R29#4.1 R33#4.2 U3#1.7
NetR31#4_2: R31#4.2 R32#3.1 U3#2.2
NetR33#4_1: R33#4.1 U3#1.6

Not connected (* = marked no-connect by the designer): N5#4 2(NC); N6#4 2(NC); N7#3 2(NC); N8#4 2(NC); N9#4 2(NC); N10#3 2(NC)

### Notes on the sheet
- (in symbol FODM8071) DEFAULT:H

### Library data of the parts
C1#6 C2#4 C4#4 C6#4 C12#4 C13#4 C14#2 C15#4 C16#4 C17#4 C20#4 C21#4 C22#4 C23#4 C24#4 C25#3 C28#3 C29#4 C30#4 C31#4 C32#3 C33#4 C35#4 C37#3 = CAP
C3#4 C5#4 C9#4 C10#4 C36#3 C39#3 = ELECTRO1: Electrolytic Capacitor
C7#4 C8#4 C11#4 C18#4 C19#4 C26#4 C27#3 C34#3 C38#3 = CAP: Capacitor
N1#3 N2#4 N11#3 = VOL
N3#4 N4#4 N12#3 = B0505LM
R1#4 R2#4 R3#4 R4#4 R6#3 R8#4 R9#4 R12#4 R13#4 R14#4 R15#4 R17#4 R19#4 R20#4 R23#4 R24#4 R25#4 R26#4 R28#4 R30#4 R31#4 = Res2: Resistor; Value: 1K; Published: 8-Jun-2000; LatestRevisionDate: 17-Jul-2002; LatestRevisionNote: Re-released for DXP Platform.; PackageReference: AXIAL-0.4; Publisher: Altium Limited
R5#4 R7#4 R10#4 R11#4 R16#4 R18#4 R21#4 R22#4 R27#3 R29#4 R32#3 R33#4 = RES2
U1#3 U2#2 U3#1 U3#2 = 1458
XS1#17 = Header 9: Header, 9-Pin; LatestRevisionDate: 17-Jul-2002; LatestRevisionNote: Re-released for DXP Platform.; Publisher: Altium Limited
XS2#16 = Header 5: Header, 5-Pin; LatestRevisionDate: 17-Jul-2002; LatestRevisionNote: Re-released for DXP Platform.; Publisher: Altium Limited

## Nets that join several sheets
24V: 信号采集板 (9 pins), 驱动 (5 pins)
24VGND: 1.5KW总控制板新 (60 pins), 信号采集板 (9 pins)
+5V: 1.5KW总控制板新 (45 pins), 信号采集板 (39 pins), 驱动 (32 pins)
+5VISO1: 1.5KW总控制板新 (9 pins), 电源调压板 (7 pins)
+5VISO2: 信号采集板 (6 pins), 电源调压板 (7 pins)
+12V: 1.5KW总控制板新 (27 pins), 电源调压板 (10 pins)
DGND: 1.5KW总控制板新 (23 pins), 信号采集板 (52 pins), 驱动 (5 pins), 电源调压板 (16 pins)
DP1: 1.5KW总控制板新 (N23.6 U2#1.103), 信号采集板 (N4#2.6 U1#2.51)
DP2: 1.5KW总控制板新 (N23.7 U2#1.104), 信号采集板 (N4#2.7 U1#2.52)
GND: 1.5KW总控制板新 (162 pins), 信号采集板 (63 pins), 驱动 (55 pins), 电源调压板 (10 pins)
GNDISO2: 信号采集板 (14 pins), 电源调压板 (16 pins)
VDD: 1.5KW总控制板新 (41 pins), 信号采集板 (19 pins)
VSS: 走线图2 (C1#2.2 XS1#2.5), 走线图3 (C1#4.2 XS01.5), 驱动 (7 pins)
TCK: 1.5KW总控制板新 (R101.2 U2#1.109 XS6#1.10), 信号采集板 (U1#2.59 XS4#5.4)
TDI: 1.5KW总控制板新 (R95.2 U2#1.110 XS6#1.5), 信号采集板 (U1#2.60 XS4#5.7)
TDO: 1.5KW总控制板新 (R93.2 U2#1.133 XS6#1.9), 信号采集板 (U1#2.61 XS4#5.6)
TMS: 1.5KW总控制板新 (R94.2 U2#1.105 XS6#1.7), 信号采集板 (U1#2.58 XS4#5.5)